# EAGLE schematic 001000-001 (EAGLE 9.4.0)

## Sheet 1 of 6
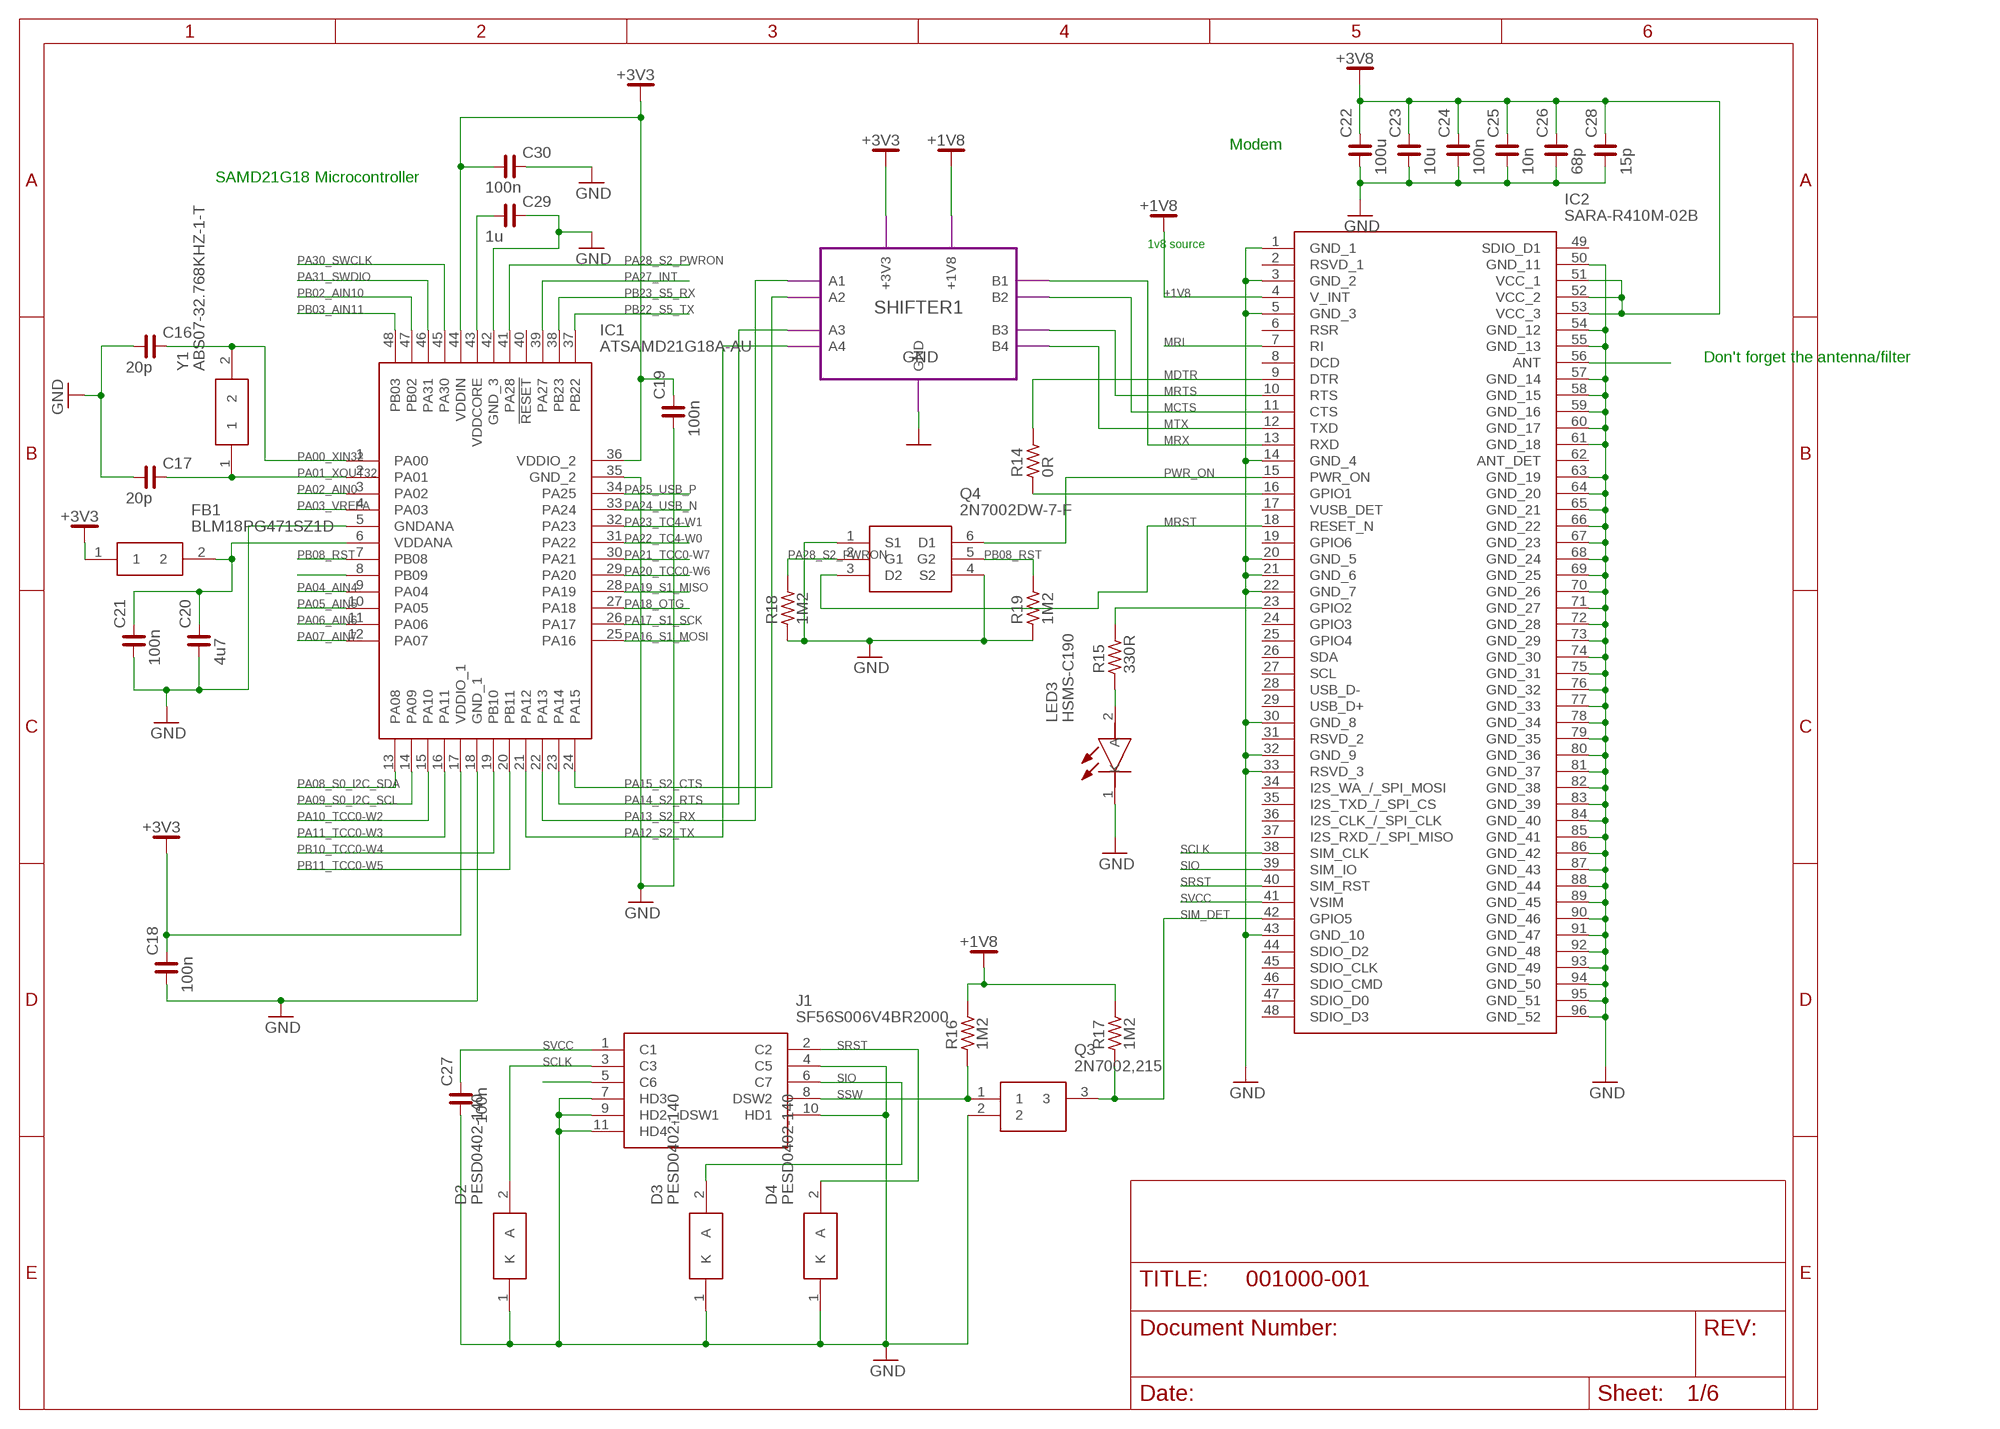
[diagram p0: schematic, sheet 1]

### Parts
C16  20p  C_0402  [C0402]
C17  20p  C_0402  [C0402]
C18  100n  C_0402  [C0402]
C19  100n  C_0402  [C0402]
C20  4u7  C_0603  [C0603]
C21  100n  C_0402  [C0402]
C22  100u  C_1206  [C1206]
C23  10u  C_0603  [C0603]
C24  100n  C_0402  [C0402]
C25  10n  C_0402  [C0402]
C26  68p  C_0402  [C0402]
C27  100n  C_0402  [C0402]
C28  15p  C_0402  [C0402]
C29  1u  C_0402  [C0402]
C30  100n  C_0402  [C0402]
D2  PESD0402-140  [DIONC1005X43N]
D3  PESD0402-140  [DIONC1005X43N]
D4  PESD0402-140  [DIONC1005X43N]
FB1  BLM18PG471SZ1D  [BEADC1608X95N]
IC1  ATSAMD21G18A-AU  [QFP50P900X900X120-48N]
IC2  SARA-R410M-02B  [SARA-U201-03B]
J1  SF56S006V4BR2000  [SF56S006V4BR2000]
LED3  HSMS-C190  [LEDC1608X90N]
Q3  2N7002,215  [SOT95P230X110-3N]
Q4  2N7002DW-7-F  [SOT65P210X100-6N]
R14  0R  R_0402  [R0402]
R15  330R  R_0402  [R0402]
R16  1M2  R_0402  [R0402]
R17  1M2  R_0402  [R0402]
R18  1M2  R_0402  [R0402]
R19  1M2  R_0402  [R0402]
Y1  ABS07-32.768KHZ-1-T  [ABS0716632768KHZT]

### Module instances
SHIFTER1 = SHIFTER

### Nets
+1V8: IC2.4(V_INT) R16.2 R17.2 ; port SHIFTER1.+1V8
+3V3: C18.2 C19.2 C30.1 FB1.1 IC1.17(VDDIO_1) IC1.36(VDDIO_2) IC1.44(VDDIN) ; port SHIFTER1.+3V3 ; also sheet 2,3,4,5
+3V8: C22.2 C23.2 C24.2 C25.2 C26.2 C28.2 IC2.51(VCC_1) IC2.52(VCC_2) IC2.53(VCC_3) ; also sheet 2
GND: C16.1 C17.1 C18.1 C19.1 C20.1 C21.1 C22.1 C23.1 C24.1 C25.1 C26.1 C27.1 C28.1 C29.2 C30.2 D2.1(K) D3.1(K) D4.1(K) IC1.5(GNDANA) IC1.18(GND_1) IC1.35(GND_2) IC1.42(GND_3) IC2.1(GND_1) IC2.3(GND_2) IC2.5(GND_3) IC2.14(GND_4) IC2.20(GND_5) IC2.21(GND_6) IC2.22(GND_7) IC2.30(GND_8) IC2.32(GND_9) IC2.33(RSVD_3) IC2.43(GND_10) IC2.50(GND_11) IC2.54(GND_12) IC2.55(GND_13) IC2.57(GND_14) IC2.58(GND_15) IC2.59(GND_16) IC2.60(GND_17) IC2.61(GND_18) IC2.63(GND_19) IC2.64(GND_20) IC2.65(GND_21) IC2.66(GND_22) IC2.67(GND_23) IC2.68(GND_24) IC2.69(GND_25) IC2.70(GND_26) IC2.71(GND_27) IC2.72(GND_28) IC2.73(GND_29) IC2.74(GND_30) IC2.75(GND_31) IC2.76(GND_32) IC2.77(GND_33) IC2.78(GND_34) IC2.79(GND_35) IC2.80(GND_36) IC2.81(GND_37) IC2.82(GND_38) IC2.83(GND_39) IC2.84(GND_40) IC2.85(GND_41) IC2.86(GND_42) IC2.87(GND_43) IC2.88(GND_44) IC2.89(GND_45) IC2.90(GND_46) IC2.91(GND_47) IC2.92(GND_48) IC2.93(GND_49) IC2.94(GND_50) IC2.95(GND_51) IC2.96(GND_52) J1.4(C5) J1.7(HD3) J1.9(HD2,_DSW1) J1.10(HD1) J1.11(HD4) LED3.1(K) Q3.2 Q4.1(S1) Q4.4(S2) R18.1 R19.1 ; port SHIFTER1.GND ; also sheet 2,3,4,5
MCTS: IC2.11(CTS) ; port SHIFTER1.B2
MDTR: IC2.9(DTR) R14.2
MRI: IC2.7(RI)
MRST: IC2.18(RESET_N) Q4.3(D2)
MRTS: IC2.10(RTS) ; port SHIFTER1.B3
MRX: IC2.13(RXD) ; port SHIFTER1.B1
MTX: IC2.12(TXD) ; port SHIFTER1.B4
N$1: C20.2 C21.2 FB1.2 IC1.6(VDDANA)
N$2: IC2.56(ANT)
N$3: IC2.16(GPIO1) R14.1
N$4: IC2.23(GPIO2) R15.2
N$22: LED3.2(A) R15.1
N$24: J1.5(C6)
N$25: IC1.8(PB09)
N$26: C29.1 IC1.43(VDDCORE)
PA00_XIN32: C16.2 IC1.1(PA00) Y1.2
PA01_XOUT32: C17.2 IC1.2(PA01) Y1.1
PA02_AIN0: IC1.3(PA02) ; also sheet 4
PA03_VREFA: IC1.4(PA03)
PA04_AIN4: IC1.9(PA04) ; also sheet 3
PA05_AIN5: IC1.10(PA05)
PA06_AIN6: IC1.11(PA06)
PA07_AIN7: IC1.12(PA07) ; also sheet 4
PA08_S0_I2C_SDA: IC1.13(PA08) ; also sheet 2,3
PA09_S0_I2C_SCL: IC1.14(PA09) ; also sheet 2,3
PA10_TCC0-W2: IC1.15(PA10)
PA11_TCC0-W3: IC1.16(PA11) ; also sheet 4
PA12_S2_TX: IC1.21(PA12) ; port SHIFTER1.A4
PA13_S2_RX: IC1.22(PA13) ; port SHIFTER1.A1
PA14_S2_RTS: IC1.23(PA14) ; port SHIFTER1.A3
PA15_S2_CTS: IC1.24(PA15) ; port SHIFTER1.A2
PA16_S1_MOSI: IC1.25(PA16) ; also sheet 3,4
PA17_S1_SCK: IC1.26(PA17) ; also sheet 3,4
PA18_OTG: IC1.27(PA18) ; also sheet 2
PA19_S1_MISO: IC1.28(PA19) ; also sheet 3,4
PA20_TCC0-W6: IC1.29(PA20) ; also sheet 3
PA21_TCC0-W7: IC1.30(PA21) ; also sheet 4
PA22_TC4-W0: IC1.31(PA22) ; also sheet 3
PA23_TC4-W1: IC1.32(PA23) ; also sheet 3
PA24_USB_N: IC1.33(PA24)
PA25_USB_P: IC1.34(PA25)
PA27_INT: IC1.39(PA27) ; also sheet 2
PA28_S2_PWRON: IC1.41(PA28) Q4.2(G1) R18.2
PA30_SWCLK: IC1.45(PA30)
PA31_SWDIO: IC1.46(PA31)
PB02_AIN10: IC1.47(PB02) ; also sheet 3
PB03_AIN11: IC1.48(PB03) ; also sheet 3
PB08_RST: IC1.7(PB08) Q4.5(G2) R19.2
PB10_TCC0-W4: IC1.19(PB10) ; also sheet 3
PB11_TCC0-W5: IC1.20(PB11) ; also sheet 3
PB22_S5_TX: IC1.37(PB22) ; also sheet 5
PB23_S5_RX: IC1.38(PB23) ; also sheet 5
PWR_ON: IC2.15(PWR_ON) Q4.6(D1)
SCLK: D2.2(A) IC2.38(SIM_CLK) J1.3(C3)
SIM_DET: IC2.42(GPIO5) Q3.3 R17.1
SIO: D3.2(A) IC2.39(SIM_IO) J1.6(C7)
SRST: D4.2(A) IC2.40(SIM_RST) J1.2(C2)
SSW: J1.8(DSW2) Q3.1 R16.1
SVCC: C27.2 IC2.41(VSIM) J1.1(C1)
Unconnected: IC1.40(!RESET) IC2.2(RSVD_1) IC2.6(RSR) IC2.8(DCD) IC2.17(VUSB_DET) IC2.19(GPIO6) IC2.24(GPIO3) IC2.25(GPIO4) IC2.26(SDA) IC2.27(SCL) IC2.28(USB_D-) IC2.29(USB_D+) IC2.31(RSVD_2) IC2.34(I2S_WA_/_SPI_MOSI) IC2.35(I2S_TXD_/_SPI_CS) IC2.36(I2S_CLK_/_SPI_CLK) IC2.37(I2S_RXD_/_SPI_MISO) IC2.44(SDIO_D2) IC2.45(SDIO_CLK) IC2.46(SDIO_CMD) IC2.47(SDIO_D0) IC2.48(SDIO_D3) IC2.49(SDIO_D1) IC2.62(ANT_DET)

### Notes on the sheet
- Modem
- SAMD21G18 Microcontroller
- 1v8 source
- Don't forget the antenna/filter

## Sheet 2 of 6
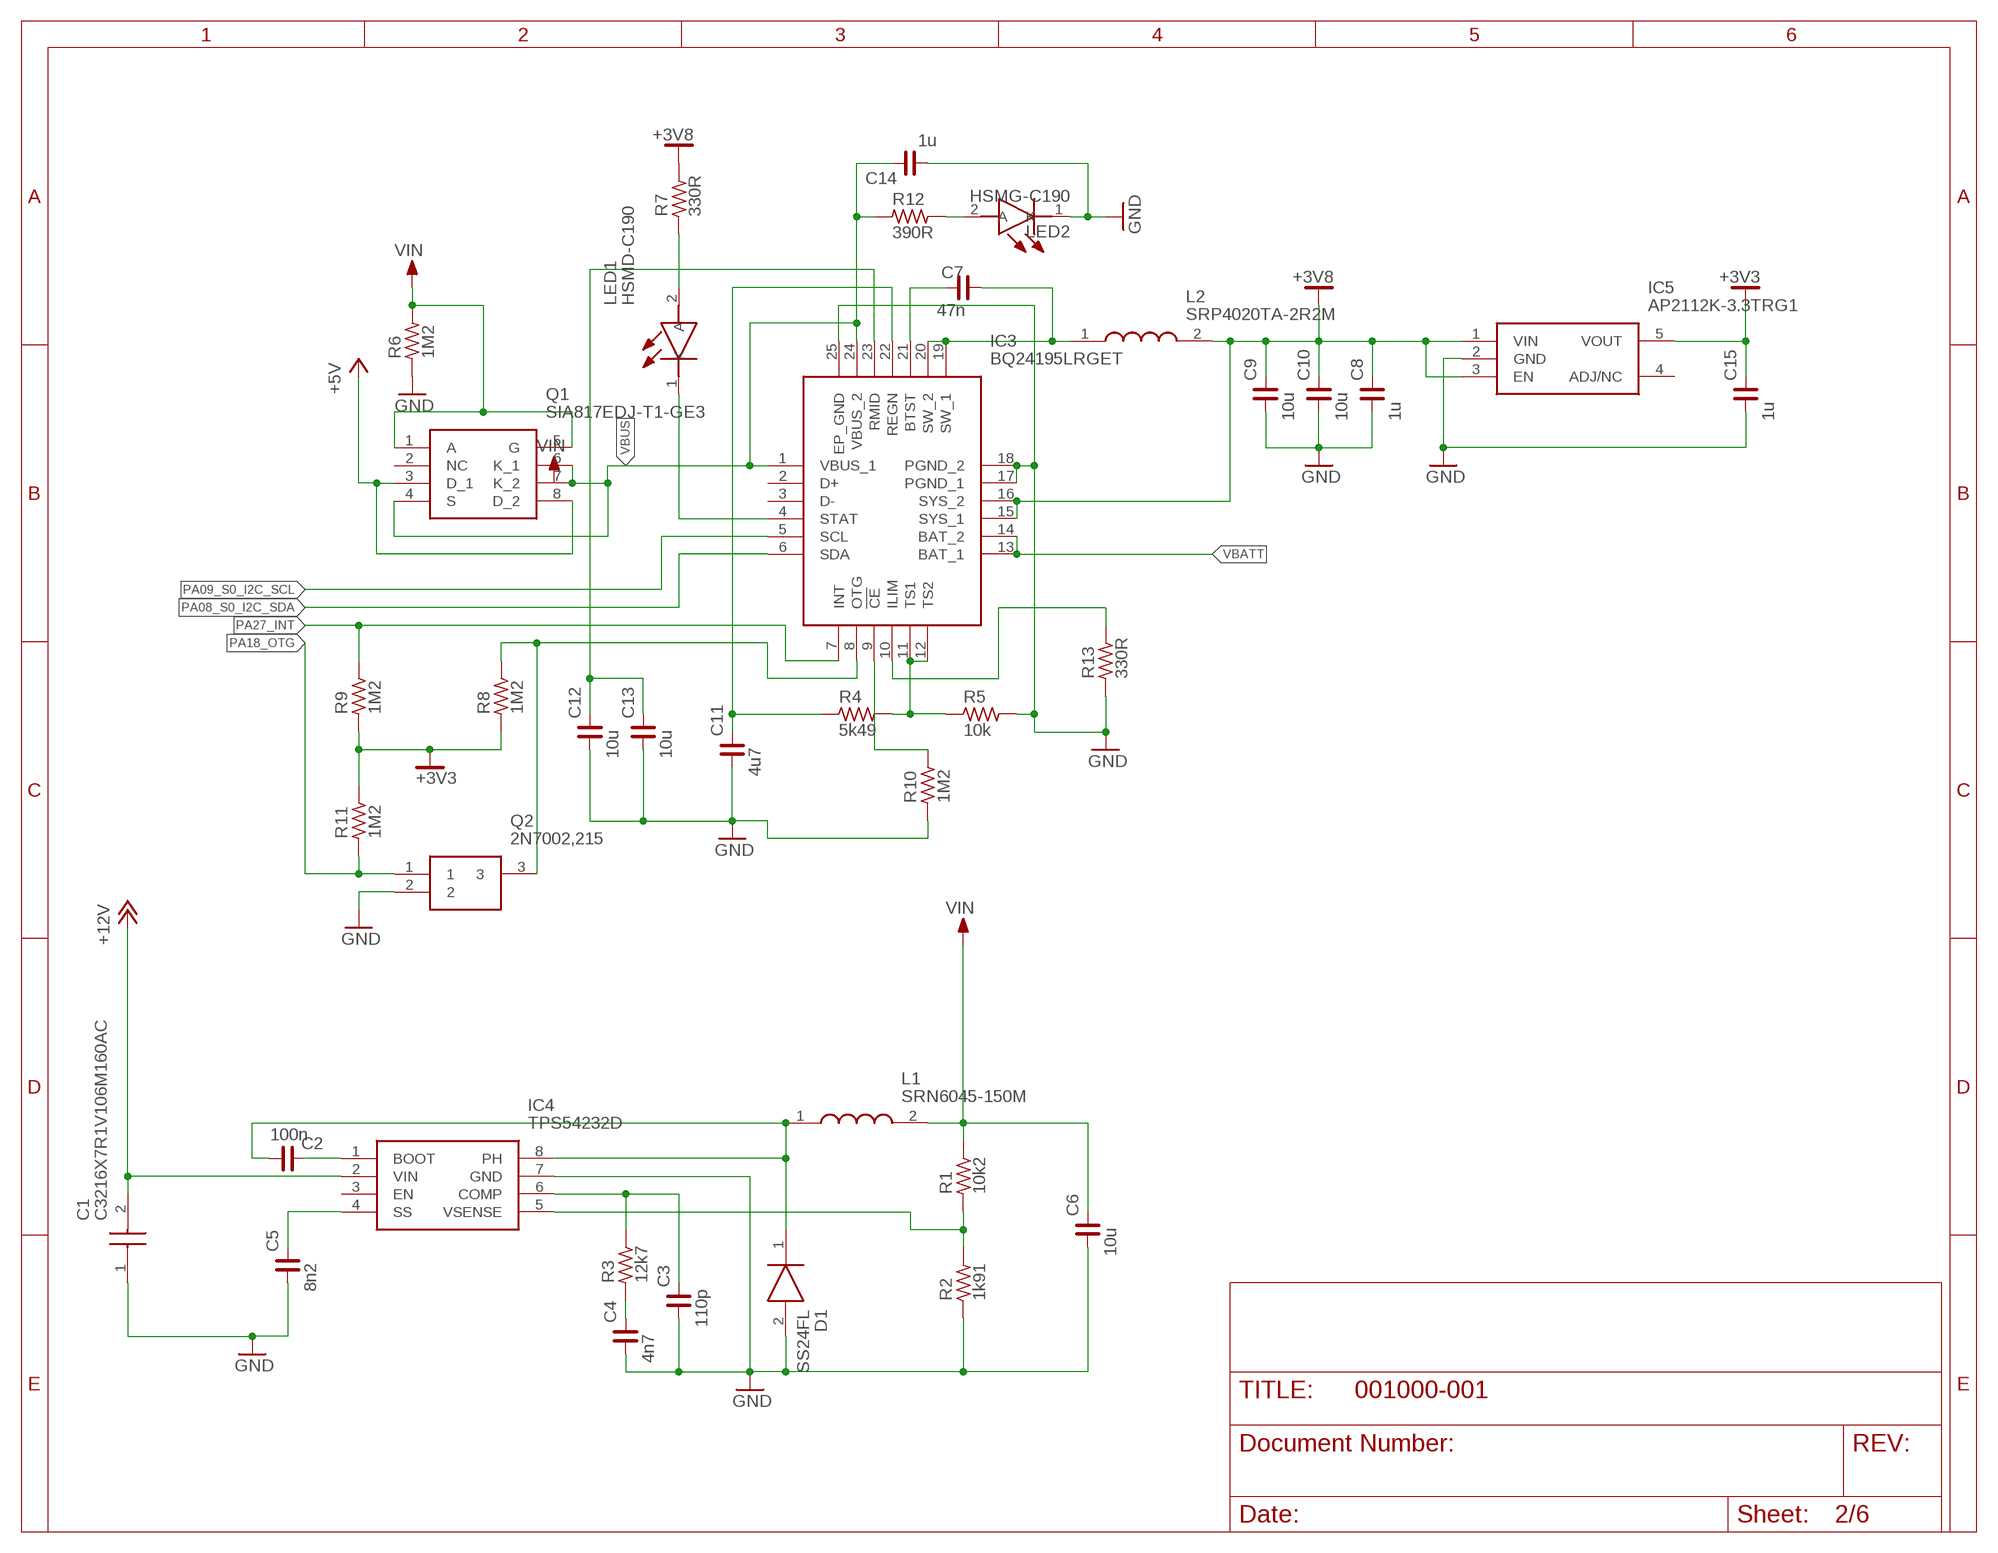
[diagram p1: schematic, sheet 2]

### Parts
C1  C3216X7R1V106M160AC  [CAPC3216X180N]
C2  100n  C_0402  [C0402]
C3  110p  C_0402  [C0402]
C4  4n7  C_0402  [C0402]
C5  8n2  C_0402  [C0402]
C6  10u  C_0603  [C0603]
C7  47n  C_0402  [C0402]
C8  1u  C_0402  [C0402]
C9  10u  C_0603  [C0603]
C10  10u  C_0603  [C0603]
C11  4u7  C_0402  [C0402]
C12  10u  C_0603  [C0603]
C13  10u  C_0603  [C0603]
C14  1u  C_0402  [C0402]
C15  1u  C_0402  [C0402]
D1  SS24FL  [SODFL3617X108N]
IC3  BQ24195LRGET  [QFN50P400X400X100-25N]
IC4  TPS54232D  [SOIC127P600X175-8N]
IC5  AP2112K-3.3TRG1  [SOT95P282X130-5N]
L1  SRN6045-150M  [SRN6045_1]
L2  SRP4020TA-2R2M  [INDC4441X200N]
LED1  HSMD-C190  [LEDC1608X80N]
LED2  HSMG-C190  [LEDC1608X90N]
Q1  SIA817EDJ-T1-GE3  [SIA537EDJT1GE3]
Q2  2N7002,215  [SOT95P230X110-3N]
R1  10k2  R_0402  [R0402]
R2  1k91  R_0402  [R0402]
R3  12k7  R_0402  [R0402]
R4  5k49  R_0402  [R0402]
R5  10k  R_0402  [R0402]
R6  1M2  R_0402  [R0402]
R7  330R  R_0402  [R0402]
R8  1M2  R_0402  [R0402]
R9  1M2  R_0402  [R0402]
R10  1M2  R_0402  [R0402]
R11  1M2  R_0402  [R0402]
R12  390R  R_0402  [R0402]
R13  330R  R_0402  [R0402]

### Nets
+3V3: C15.2 IC5.5(VOUT) R8.1 R9.1 R11.2 ; also sheet 1,3,4,5
+3V8: C8.2 C9.2 C10.2 IC3.15(SYS_1) IC3.16(SYS_2) IC5.1(VIN) IC5.3(EN) L2.2 R7.2 ; also sheet 1
+5V: Q1.3(D_1) Q1.8(D_2)
+12V: C1.2 IC4.2(VIN)
GND: C1.1 C3.1 C4.1 C5.1 C6.1 C8.1 C9.1 C10.1 C11.1 C12.1 C13.1 C14.1 C15.1 D1.2(A) IC3.17(PGND_1) IC3.18(PGND_2) IC3.25(EP_GND) IC4.7(GND) IC5.2(GND) LED2.1(K) Q2.2 R2.1 R5.2 R6.1 R10.1 R13.1 ; also sheet 1,3,4,5
N$5: C2.2 IC4.1(BOOT)
N$6: C2.1 D1.1(K) IC4.8(PH) L1.1
N$7: C3.2 IC4.6(COMP) R3.2
N$8: C4.2 R3.1
N$9: IC4.5(VSENSE) R1.1 R2.2
N$10: IC3.4(STAT) LED1.1(K)
N$11: C5.2 IC4.4(SS)
N$12: C7.2 IC3.19(SW_1) IC3.20(SW_2) L2.1
N$13: IC3.11(TS1) IC3.12(TS2) R4.2 R5.1
N$14: C12.2 C13.2 IC3.23(RMID)
N$15: LED2.2(A) R12.2
N$16: LED1.2(A) R7.1
N$17: IC3.9(!CE) R10.2
N$18: C7.1 IC3.21(BTST)
N$19: IC3.10(ILIM) R13.2
N$20: C11.2 IC3.22(REGN) R4.1
N$21: IC3.8(OTG) Q2.3 R8.2
PA08_S0_I2C_SDA: IC3.6(SDA) ; also sheet 1,3
PA09_S0_I2C_SCL: IC3.5(SCL) ; also sheet 1,3
PA18_OTG: Q2.1 R11.1 ; also sheet 1
PA27_INT: IC3.7(INT) R9.2 ; also sheet 1
VBATT: IC3.13(BAT_1) IC3.14(BAT_2)
VBUS: C14.2 IC3.1(VBUS_1) IC3.24(VBUS_2) Q1.4(S) Q1.6(K_1) Q1.7(K_2) R12.1
VIN: C6.2 L1.2 Q1.1(A) Q1.5(G) R1.2 R6.2 ; also sheet 4
Unconnected: IC3.2(D+) IC3.3(D-) IC4.3(EN) IC5.4(ADJ/NC) Q1.2(NC)

## Sheet 3 of 6
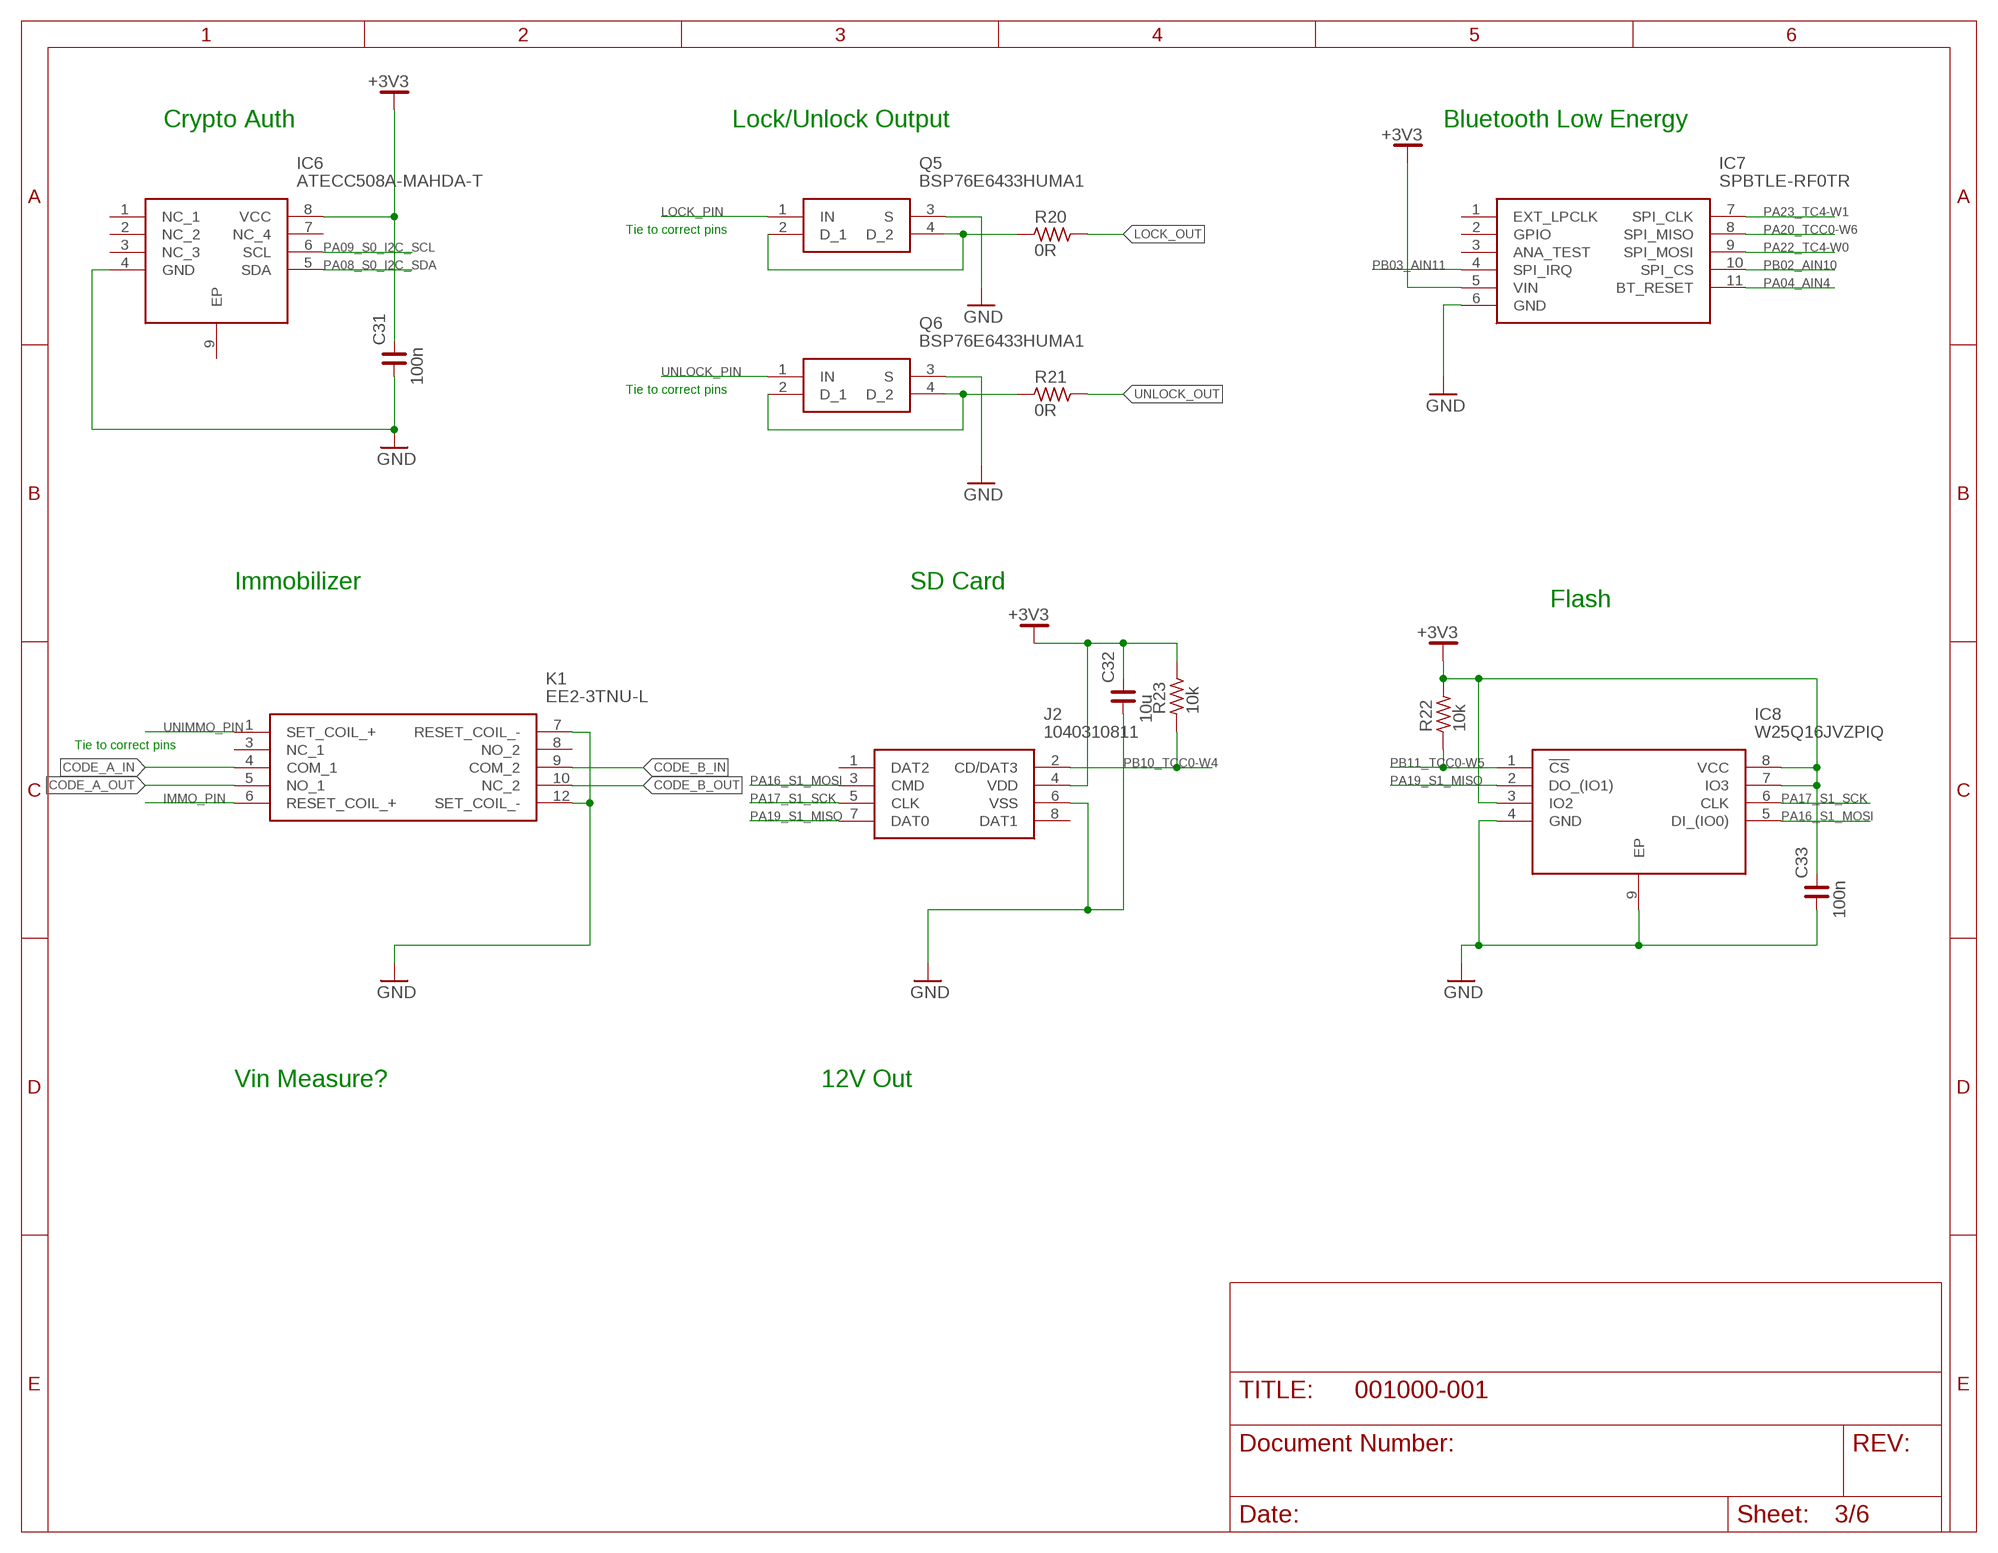
[diagram p2: schematic, sheet 3]

### Parts
C31  100n  C_0402  [C0402]
C32  10u  C_0402  [C0402]
C33  100n  C_0402  [C0402]
IC6  ATECC508A-MAHDA-T  [SON50P300X200X60-9N]
IC7  SPBTLE-RF0TR  [SPSGRF868]
IC8  W25Q16JVZPIQ  [SON127P600X500X80-9N]
J2  1040310811  [1040310811]
K1  EE2-3TNU-L  [EE25TNU]
Q5  BSP76E6433HUMA1  [SOT230P700X170-4N]
Q6  BSP76E6433HUMA1  [SOT230P700X170-4N]
R20  0R  R_1206  [R1206]
R21  0R  R_1206  [R1206]
R22  10k  R_0402  [R0402]
R23  10k  R_0402  [R0402]

### Nets
+3V3: C31.2 C32.2 C33.2 IC6.8(VCC) IC7.5(VIN) IC8.3(IO2) IC8.7(IO3) IC8.8(VCC) J2.4(VDD) R22.2 R23.2 ; also sheet 1,2,4,5
CODE_A_IN: K1.4(COM_1)
CODE_A_OUT: K1.5(NO_1)
CODE_B_IN: K1.9(COM_2)
CODE_B_OUT: K1.10(NC_2)
GND: C31.1 C32.1 C33.1 IC6.4(GND) IC7.6(GND) IC8.4(GND) IC8.9(EP) J2.6(VSS) K1.7(RESET_COIL_-) K1.12(SET_COIL_-) Q5.3(S) Q6.3(S) ; also sheet 1,2,4,5
IMMO_PIN: K1.6(RESET_COIL_+)
LOCK_OUT: R20.2
LOCK_PIN: Q5.1(IN)
N$28: Q6.2(D_1) Q6.4(D_2) R21.1
N$29: Q5.2(D_1) Q5.4(D_2) R20.1
PA04_AIN4: IC7.11(BT_RESET) ; also sheet 1
PA08_S0_I2C_SDA: IC6.5(SDA) ; also sheet 1,2
PA09_S0_I2C_SCL: IC6.6(SCL) ; also sheet 1,2
PA16_S1_MOSI: IC8.5(DI_(IO0)) J2.3(CMD) ; also sheet 1,4
PA17_S1_SCK: IC8.6(CLK) J2.5(CLK) ; also sheet 1,4
PA19_S1_MISO: IC8.2(DO_(IO1)) J2.7(DAT0) ; also sheet 1,4
PA20_TCC0-W6: IC7.8(SPI_MISO) ; also sheet 1
PA22_TC4-W0: IC7.9(SPI_MOSI) ; also sheet 1
PA23_TC4-W1: IC7.7(SPI_CLK) ; also sheet 1
PB02_AIN10: IC7.10(SPI_CS) ; also sheet 1
PB03_AIN11: IC7.4(SPI_IRQ) ; also sheet 1
PB10_TCC0-W4: J2.2(CD/DAT3) R23.1 ; also sheet 1
PB11_TCC0-W5: IC8.1(!CS) R22.1 ; also sheet 1
UNIMMO_PIN: K1.1(SET_COIL_+)
UNLOCK_OUT: R21.2
UNLOCK_PIN: Q6.1(IN)
Unconnected: IC6.1(NC_1) IC6.2(NC_2) IC6.3(NC_3) IC6.7(NC_4) IC6.9(EP) IC7.1(EXT_LPCLK) IC7.2(GPIO) IC7.3(ANA_TEST) J2.1(DAT2) J2.8(DAT1) K1.3(NC_1) K1.8(NO_2)

### Notes on the sheet
- Crypto Auth | Lock/Unlock Output | Bluetooth Low Energy
- Tie to correct pins
- Tie to correct pins
- Immobilizer | SD Card
- Flash
- Tie to correct pins
- Vin Measure? | 12V Out

## Sheet 4 of 6
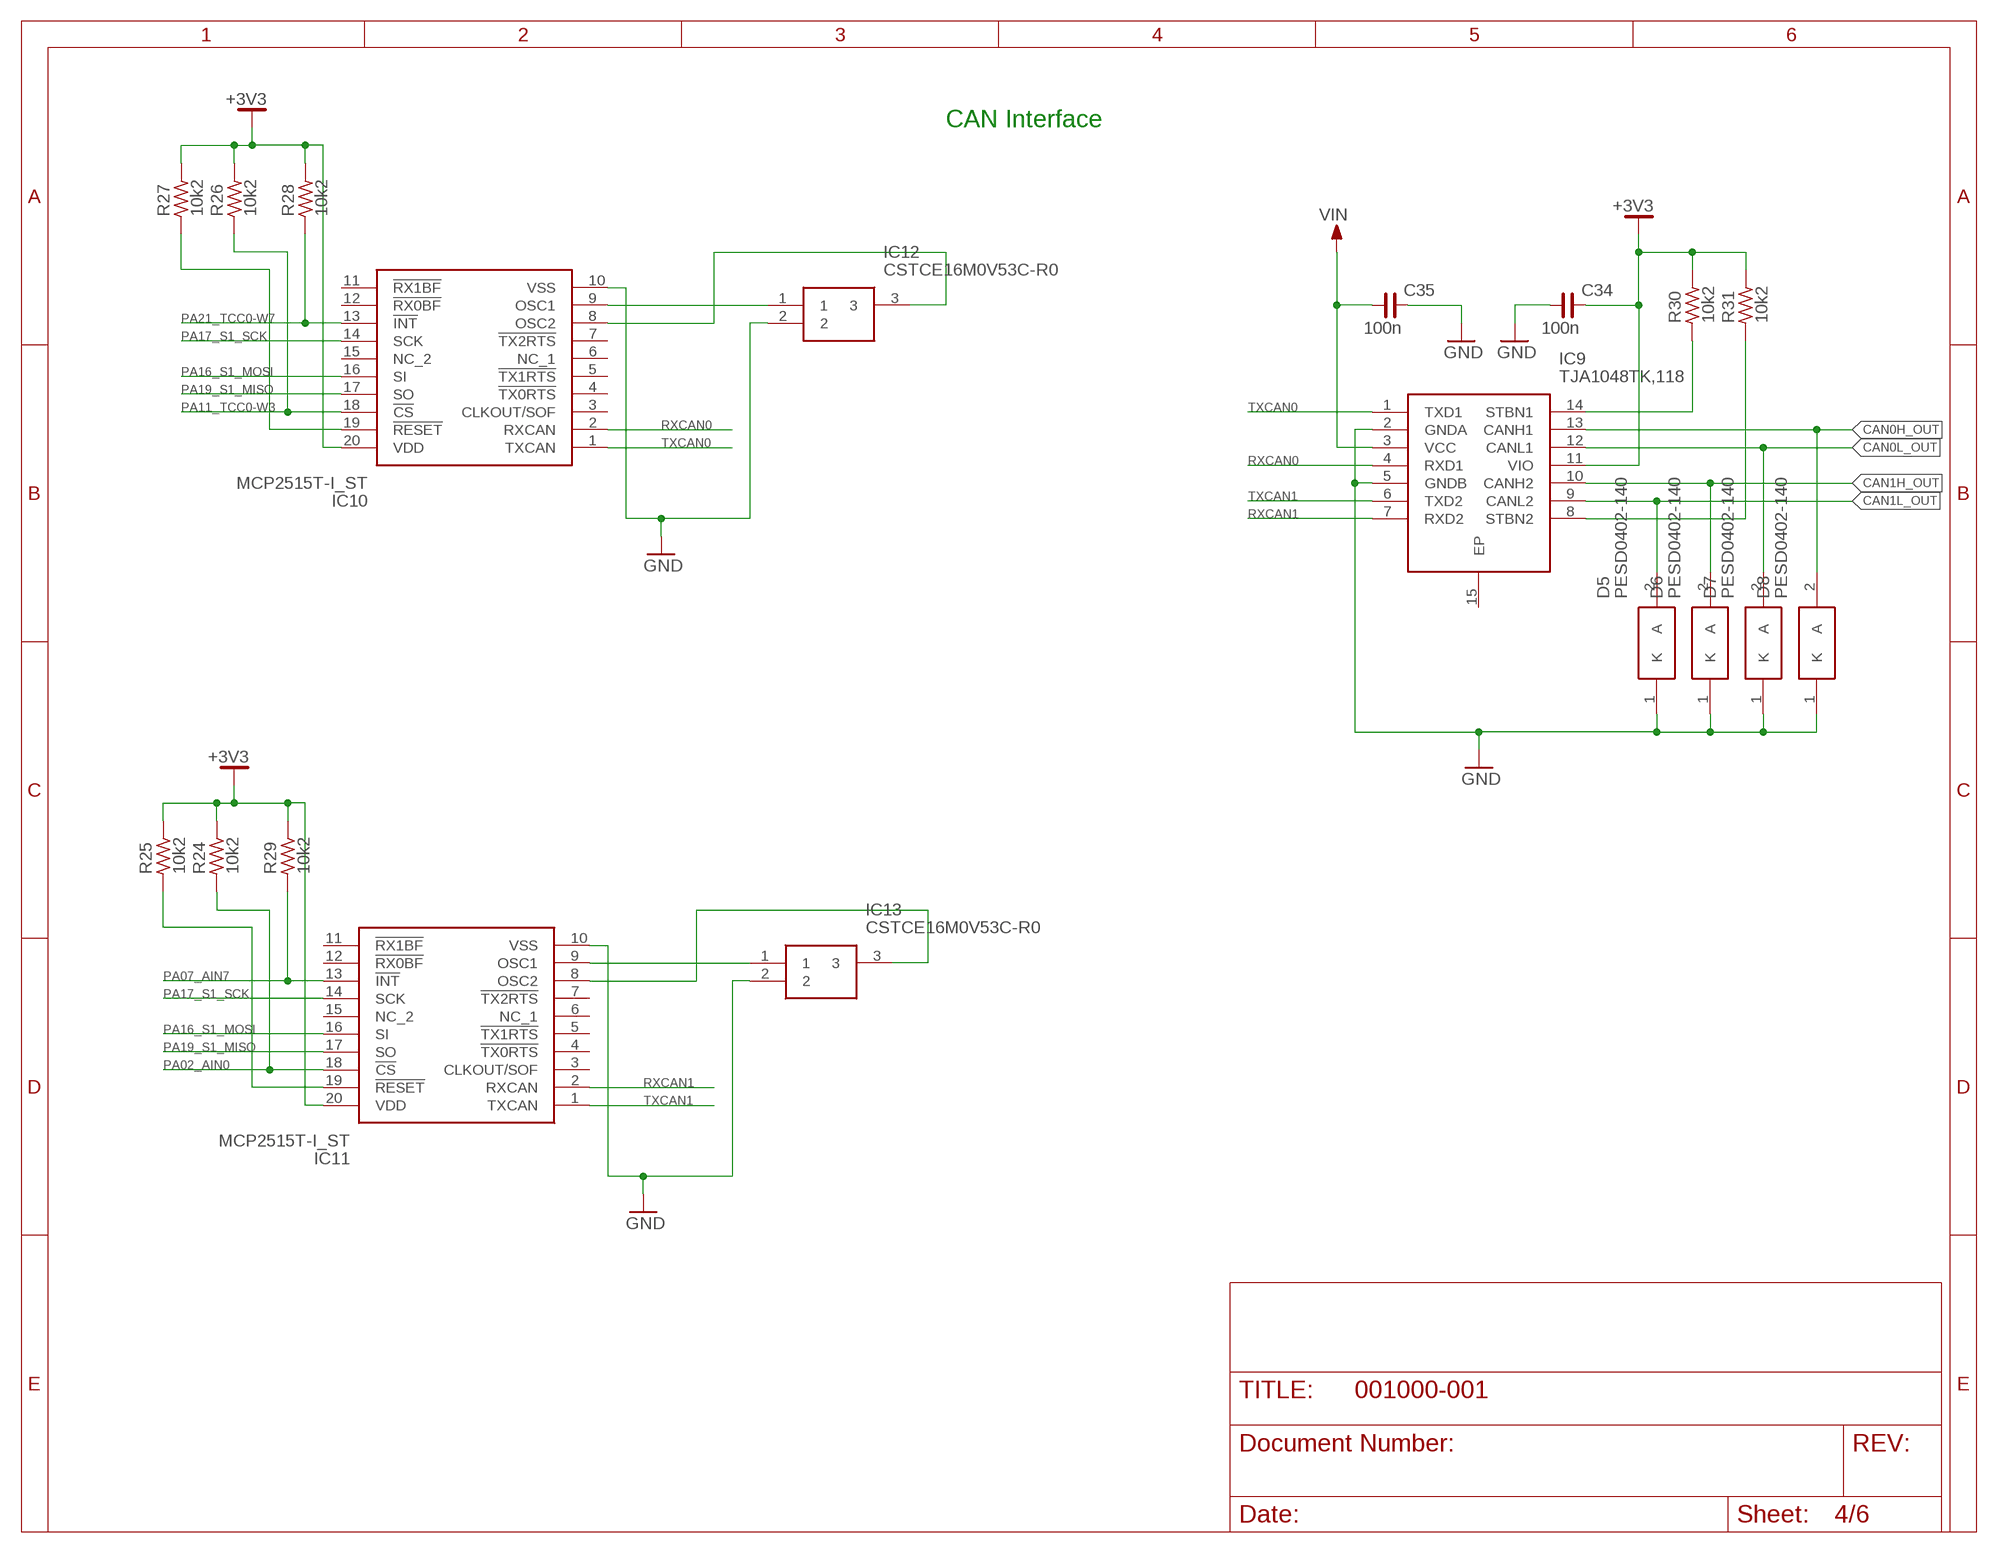
[diagram p3: schematic, sheet 4]

### Parts
C34  100n  C_0402  [C0402]
C35  100n  C_0402  [C0402]
D5  PESD0402-140  [DIONC1005X43N]
D6  PESD0402-140  [DIONC1005X43N]
D7  PESD0402-140  [DIONC1005X43N]
D8  PESD0402-140  [DIONC1005X43N]
IC9  TJA1048TK,118  [SON65P300X450X100-15N]
IC10  MCP2515T-I_ST  [SOP65P640X120-20N]
IC11  MCP2515T-I_ST  [SOP65P640X120-20N]
IC12  CSTCE16M0V53C-R0  [CSTCE16M0V53CR0]
IC13  CSTCE16M0V53C-R0  [CSTCE16M0V53CR0]
R24  10k2  R_0402  [R0402]
R25  10k2  R_0402  [R0402]
R26  10k2  R_0402  [R0402]
R27  10k2  R_0402  [R0402]
R28  10k2  R_0402  [R0402]
R29  10k2  R_0402  [R0402]
R30  10k2  R_0402  [R0402]
R31  10k2  R_0402  [R0402]

### Nets
+3V3: C34.2 IC9.11(VIO) IC10.20(VDD) IC11.20(VDD) R24.2 R25.2 R26.2 R27.2 R28.2 R29.2 R30.2 R31.2 ; also sheet 1,2,3,5
CAN0H_OUT: D8.2(A) IC9.13(CANH1)
CAN0L_OUT: D7.2(A) IC9.12(CANL1)
CAN1H_OUT: D6.2(A) IC9.10(CANH2)
CAN1L_OUT: D5.2(A) IC9.9(CANL2)
GND: C34.1 C35.2 D5.1(K) D6.1(K) D7.1(K) D8.1(K) IC9.2(GNDA) IC9.5(GNDB) IC10.10(VSS) IC11.10(VSS) IC12.2 IC13.2 ; also sheet 1,2,3,5
N$27: IC10.9(OSC1) IC12.1
N$30: IC10.8(OSC2) IC12.3
N$31: IC9.14(STBN1) R30.1
N$32: IC11.9(OSC1) IC13.1
N$33: IC11.8(OSC2) IC13.3
N$34: IC9.8(STBN2) R31.1
N$39: IC11.19(!RESET) R25.1
N$42: IC10.19(!RESET) R27.1
PA02_AIN0: IC11.18(!CS) R24.1 ; also sheet 1
PA07_AIN7: IC11.13(!INT) R29.1 ; also sheet 1
PA11_TCC0-W3: IC10.18(!CS) R26.1 ; also sheet 1
PA16_S1_MOSI: IC10.16(SI) IC11.16(SI) ; also sheet 1,3
PA17_S1_SCK: IC10.14(SCK) IC11.14(SCK) ; also sheet 1,3
PA19_S1_MISO: IC10.17(SO) IC11.17(SO) ; also sheet 1,3
PA21_TCC0-W7: IC10.13(!INT) R28.1 ; also sheet 1
RXCAN0: IC9.4(RXD1) IC10.2(RXCAN)
RXCAN1: IC9.7(RXD2) IC11.2(RXCAN)
TXCAN0: IC9.1(TXD1) IC10.1(TXCAN)
TXCAN1: IC9.6(TXD2) IC11.1(TXCAN)
VIN: C35.1 IC9.3(VCC) ; also sheet 2
Unconnected: IC9.15(EP) IC10.3(CLKOUT/SOF) IC10.4(!TX0RTS) IC10.5(!TX1RTS) IC10.6(NC_1) IC10.7(!TX2RTS) IC10.11(!RX1BF) IC10.12(!RX0BF) IC10.15(NC_2) IC11.3(CLKOUT/SOF) IC11.4(!TX0RTS) IC11.5(!TX1RTS) IC11.6(NC_1) IC11.7(!TX2RTS) IC11.11(!RX1BF) IC11.12(!RX0BF) IC11.15(NC_2)

### Notes on the sheet
- CAN Interface

## Sheet 5 of 6
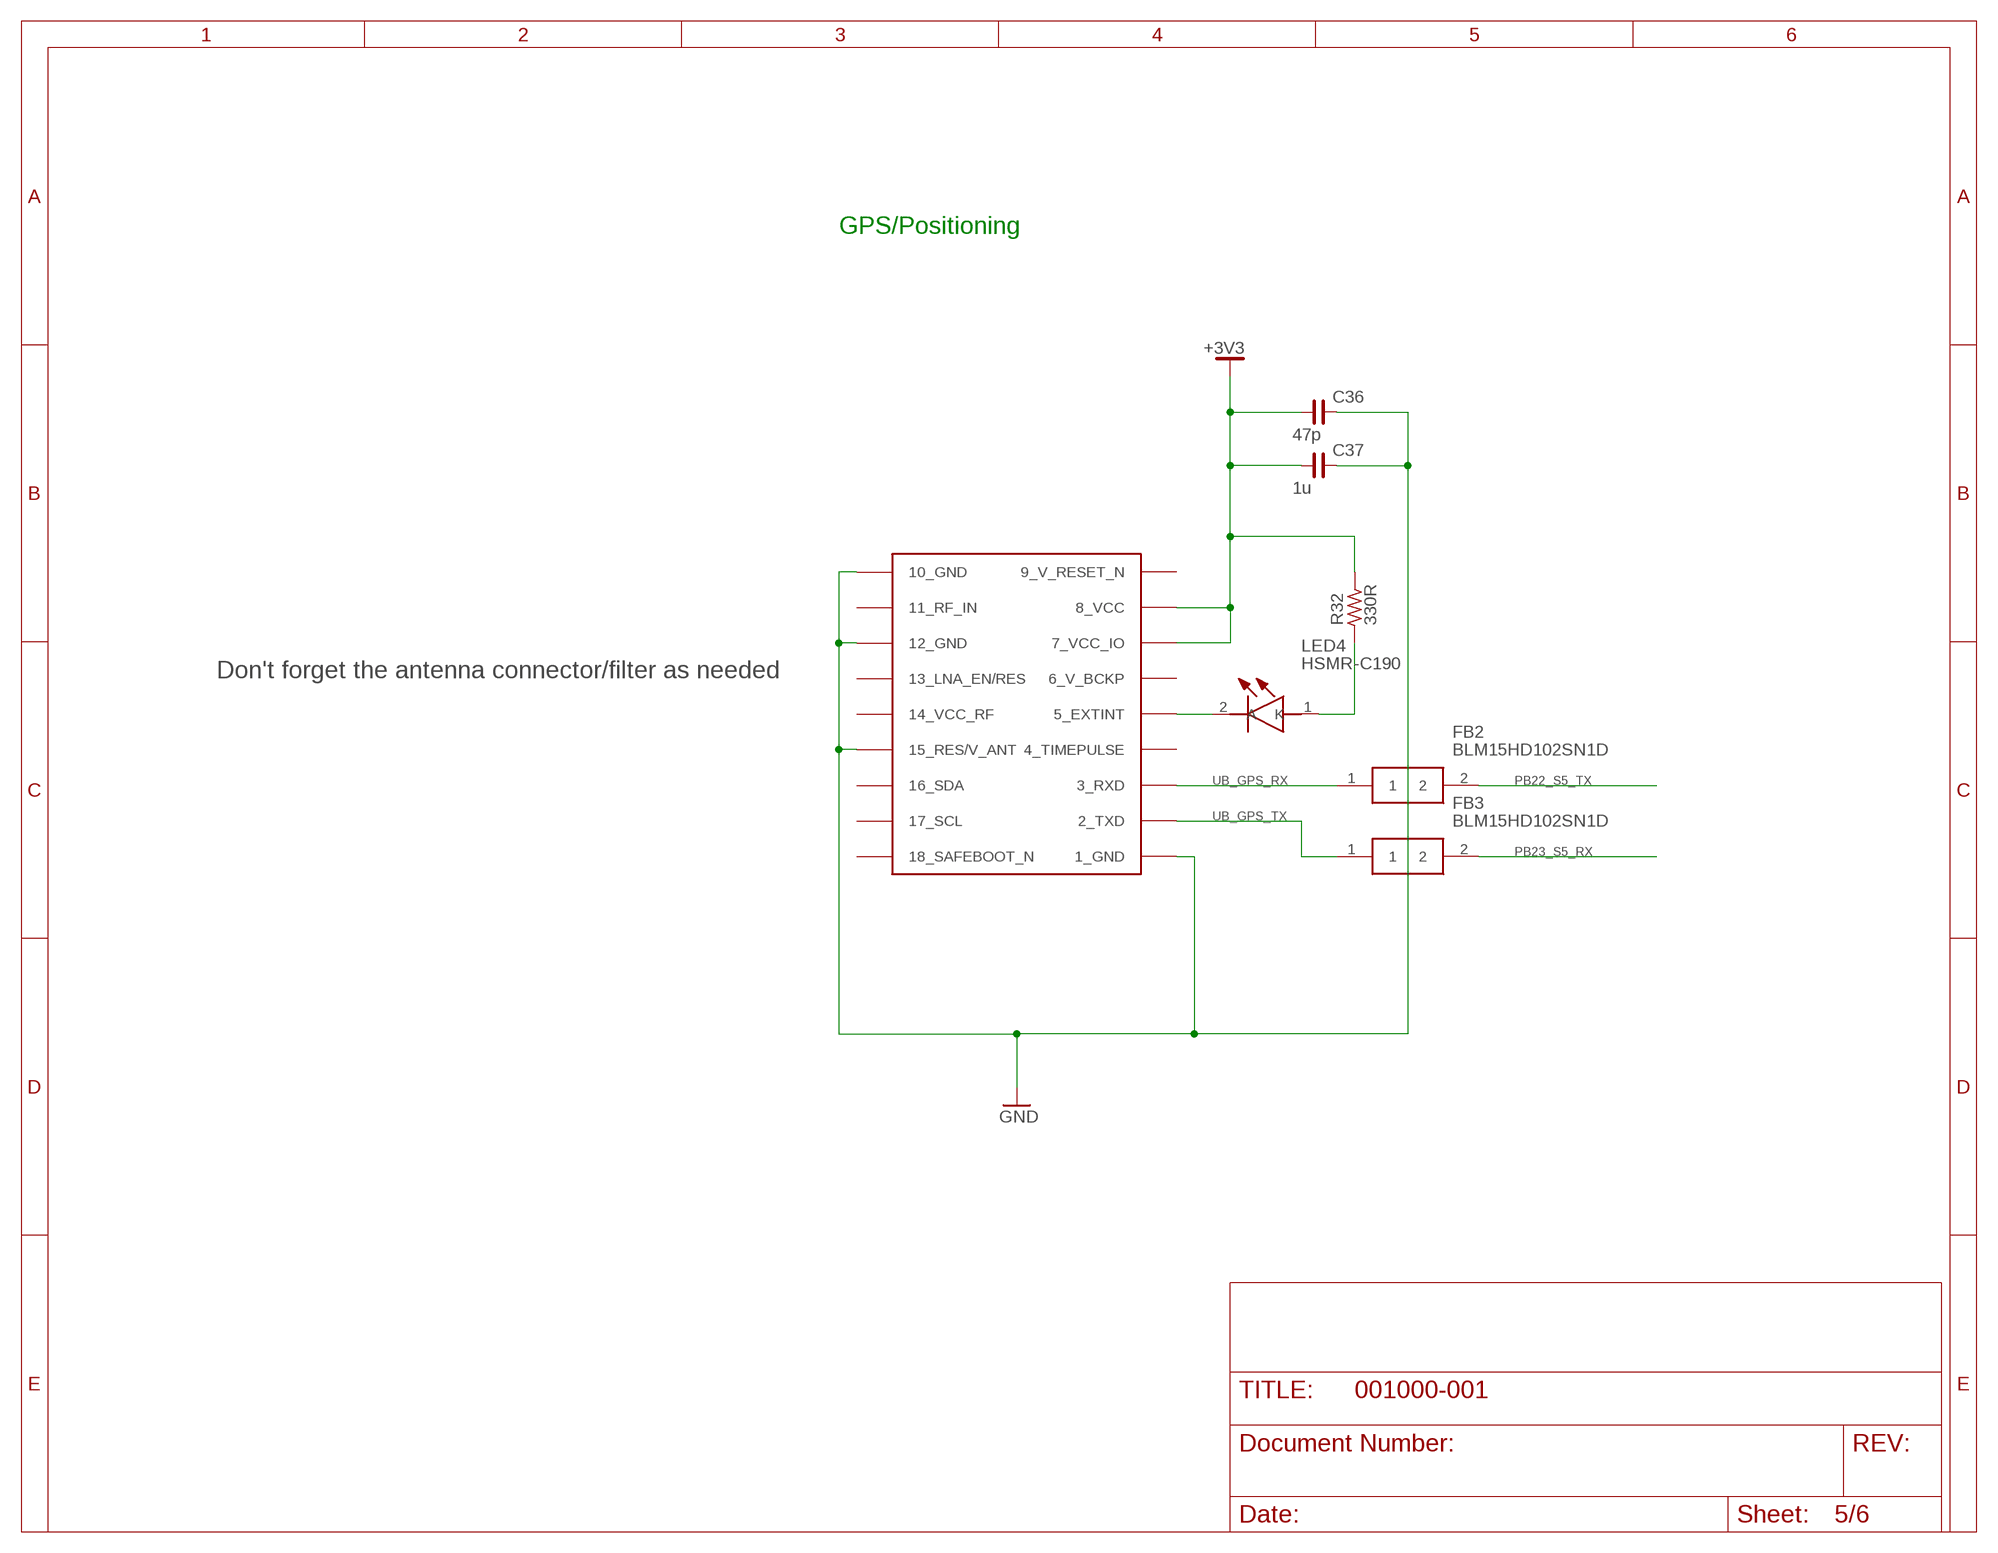
[diagram p4: schematic, sheet 5]

### Parts
C36  47p  C_0402  [C0402]
C37  1u  C_0603  [C0603]
FB2  BLM15HD102SN1D  [BEADC1005X55N]
FB3  BLM15HD102SN1D  [BEADC1005X55N]
LED4  HSMR-C190  [LEDC1608X80N]
R32  330R  R_0402  [R0402]
U$1  MAX-M8  [MAX-M8]

### Nets
+3V3: C36.1 C37.1 R32.2 U$1.7_VCC_IO U$1.8_VCC ; also sheet 1,2,3,4
GND: C36.2 C37.2 U$1.1_GND U$1.10_GND U$1.12_GND U$1.15_V_ANT/RESERVED(15_RES/V_ANT) ; also sheet 1,2,3,4
N$35: LED4.2(A) U$1.5_EXTINT
N$36: LED4.1(K) R32.1
PB22_S5_TX: FB2.2 ; also sheet 1
PB23_S5_RX: FB3.2 ; also sheet 1
UB_GPS_RX: FB2.1 U$1.3_RXD
UB_GPS_TX: FB3.1 U$1.2_TXD
Unconnected: U$1.4_TIMEPULSE U$1.6_V_BCKP U$1.11_RF_IN U$1.13_LNA_EN(13_LNA_EN/RES) U$1.14_VCC_RF U$1.16_SDA U$1.17_SCL U$1.18_SAFEBOOT_N

### Notes on the sheet
- GPS/Positioning
- Don't forget the antenna connector/filter as needed

## Sheet 6 of 6
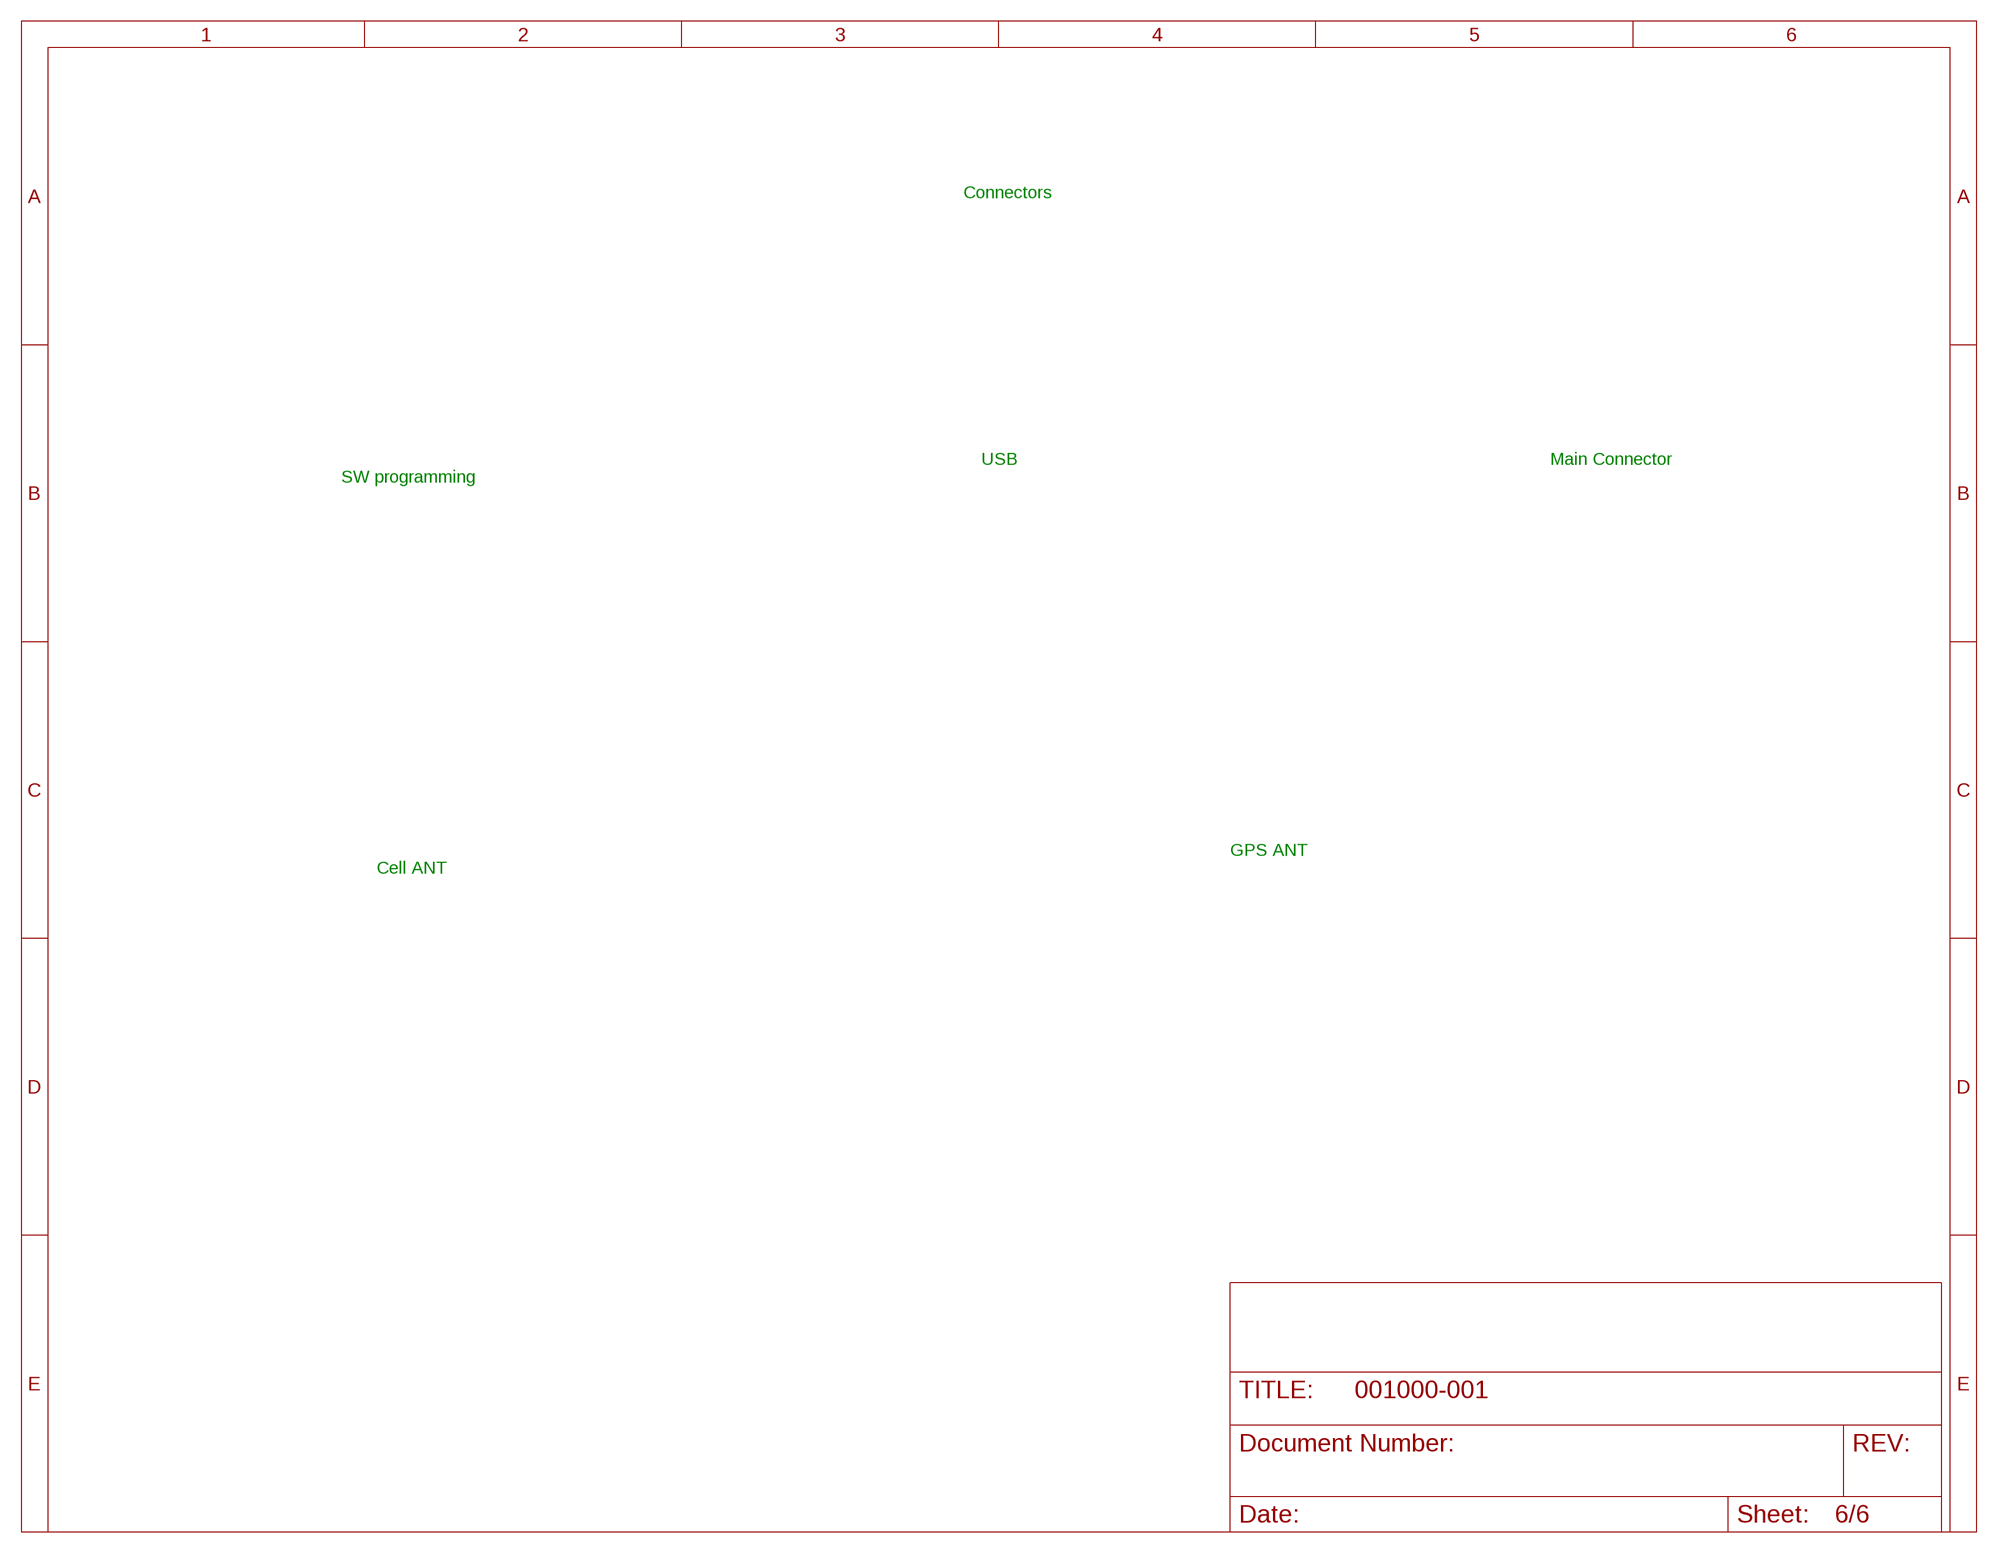
[diagram p5: schematic, sheet 6]

### Notes on the sheet
- Connectors
- USB | Main Connector
- SW programming
- GPS ANT
- Cell ANT

## Power pins joined to a net without a drawn wire
9_V_RESET_N: U$1.9_RESET_N(9_V_RESET_N)

## Library data of the parts
C1 = SamacSys_Parts:C3216X7R1V106M160AC: TDK 1206 C 10uF Ceramic Multilayer Capacitor, 35 V dc, +125C, X7R Dielectric, +/-20% Source: Datasheet <https://componentsearchengine.com/Datasheets/1/C3216X7R1V106M160AC.pdf>; DESCRIPTION: TDK 1206 C 10uF Ceramic Multilayer Capacitor, 35 V dc, +125C, X7R Dielectric, +/-20%; HEIGHT: 1.8mm; MANUFACTURER_NAME: TDK; MANUFACTURER_PART_NUMBER: C3216X7R1V106M160AC; MOUSER_PART_NUMBER: 810-C3216X7R1V106M; MOUSER_PRICE-STOCK: https://www.mouser.com/Search/Refine.aspx?Keyword=810-C3216X7R1V106M
C2-C37 = rc-master:C_: NON-POLARIZED CAP
D1 = SamacSys_Parts:SS24FL: Schottky Diodes & Rectifiers 40V, 2A SCHOTTKY Source: Datasheet <https://componentsearchengine.com/Datasheets/1/SS24FL.pdf>; DESCRIPTION: Schottky Diodes & Rectifiers 40V, 2A SCHOTTKY; HEIGHT: 1.08mm; MANUFACTURER_NAME: Fairchild Semiconductor; MANUFACTURER_PART_NUMBER: SS24FL; MOUSER_PART_NUMBER: 512-SS24FL; MOUSER_PRICE-STOCK: https://www.mouser.com/Search/Refine.aspx?Keyword=512-SS24FL
D2-D8 = SamacSys_Parts:PESD0402-140: TVS Diode Bi-Directional PESD0402-140 40V, SOD-923 2-Pin Source: Datasheet <http://www.te.com/commerce/DocumentDelivery/DDEController?Action=showdoc&DocId=Specification Or StandardSCD27440FpdfEnglishENG_SS_SCD27440_F.pdfRF1600-000.pdf>; DESCRIPTION: TVS Diode Bi-Directional PESD0402-140 40V, SOD-923 2-Pin; HEIGHT: 0.43mm; MANUFACTURER_NAME: TE Connectivity; MANUFACTURER_PART_NUMBER: PESD0402-140
FB1 = SamacSys_Parts:BLM18PG471SZ1D: Ferrite Beads 0603 470ohms 1000mA Auto Infotainment Source: Datasheet <https://componentsearchengine.com/Datasheets/1/BLM18PG471SZ1D.pdf>; DESCRIPTION: Ferrite Beads 0603 470ohms 1000mA Auto Infotainment; HEIGHT: 0.95mm; MANUFACTURER_NAME: Murata Electronics; MANUFACTURER_PART_NUMBER: BLM18PG471SZ1D; MOUSER_PART_NUMBER: 81-BLM18PG471SZ1D; MOUSER_PRICE-STOCK: https://www.mouser.com/Search/Refine.aspx?Keyword=81-BLM18PG471SZ1D
FB2 FB3 = SamacSys_Parts:BLM15HD102SN1D: MURATA - BLM15HD102SN1D - FERRITE BEAD, 1.25OHM, 250MA, 0402 Source: Datasheet <https://componentsearchengine.com/Datasheets/1/BLM15HD102SN1D.pdf>; DESCRIPTION: MURATA - BLM15HD102SN1D - FERRITE BEAD, 1.25OHM, 250MA, 0402; HEIGHT: 0.55mm; MANUFACTURER_NAME: Murata Electronics; MANUFACTURER_PART_NUMBER: BLM15HD102SN1D; MOUSER_PART_NUMBER: 81-BLM15HD102SN1D; MOUSER_PRICE-STOCK: https://www.mouser.com/Search/Refine.aspx?Keyword=81-BLM15HD102SN1D
IC1 = SamacSys_Parts:ATSAMD21G18A-AU: ATMEL - ATSAMD21G18A-AU - MCU, 32BIT, CORTEX-M0+, 48MHZ, TQFP-48 Source: Datasheet <https://componentsearchengine.com/Datasheets/1/ATSAMD21G18A-AU.pdf>; DESCRIPTION: ATMEL - ATSAMD21G18A-AU - MCU, 32BIT, CORTEX-M0+, 48MHZ, TQFP-48; HEIGHT: 1.2mm; MANUFACTURER_NAME: Microchip; MANUFACTURER_PART_NUMBER: ATSAMD21G18A-AU; MOUSER_PART_NUMBER: 556-ATSAMD21G18A-AU; MOUSER_PRICE-STOCK: https://www.mouser.com/Search/Refine.aspx?Keyword=556-ATSAMD21G18A-AU
IC2 = SamacSys_Parts:SARA-R410M-02B: Size-optimized LTE Cat M1/NB1 and EGPRS modules Source: Datasheet <https://www.u-blox.com/sites/default/files/SARA-R4-N4_DataSheet_(UBX-16024152).pdf>; DESCRIPTION: Size-optimized LTE Cat M1/NB1 and EGPRS modules; HEIGHT: mm; MANUFACTURER_NAME: U-Blox; MANUFACTURER_PART_NUMBER: SARA-R410M-02B
IC3 = SamacSys_Parts:BQ24195LRGET: I2C Controlled 2.5A/4.5A Single Cell Charger with 5.1V 1.3A/2.1A Synchronous Boost Operation Source: Datasheet <http://www.ti.com/lit/ds/symlink/bq24195l.pdf>; DESCRIPTION: I2C Controlled 2.5A/4.5A Single Cell Charger with 5.1V 1.3A/2.1A Synchronous Boost Operation; HEIGHT: 1mm; MANUFACTURER_NAME: Texas Instruments; MANUFACTURER_PART_NUMBER: BQ24195LRGET; MOUSER_PART_NUMBER: 595-BQ24195LRGET; MOUSER_PRICE-STOCK: https://www.mouser.com/Search/Refine.aspx?Keyword=595-BQ24195LRGET
IC4 = SamacSys_Parts:TPS54232D: TPS54232D, Switching Regulator, Buck Controller, 2A, Adjustable, Minimum of 0.8 V, 1200 kHz, 8-Pin SOIC Source: Datasheet <http://www.ti.com/lit/ds/symlink/tps54232.pdf>; DESCRIPTION: TPS54232D, Switching Regulator, Buck Controller, 2A, Adjustable, Minimum of 0.8 V, 1200 kHz, 8-Pin SOIC; HEIGHT: 1.75mm; MANUFACTURER_NAME: Texas Instruments; MANUFACTURER_PART_NUMBER: TPS54232D; MOUSER_PART_NUMBER: 595-TPS54232D; MOUSER_PRICE-STOCK: https://www.mouser.com/Search/Refine.aspx?Keyword=595-TPS54232D
IC5 = SamacSys_Parts:AP2112K-3.3TRG1: 600mA 3.3V LDO Regulator Enable SOT23-5 DiodesZetex AP2112K-3.3TRG1, LDO Voltage Regulator, 3.3 V +/-1.5%, 2.5 6 Vin, 5-Pin SOT-23 Source: Datasheet <https://componentsearchengine.com/Datasheets/1/AP2112K-3.3TRG1.pdf>; DESCRIPTION: 600mA 3.3V LDO Regulator Enable SOT23-5 DiodesZetex AP2112K-3.3TRG1, LDO Voltage Regulator, 3.3 V +/-1.5%, 2.5 6 Vin, 5-Pin SOT-23; HEIGHT: 1.3mm; MANUFACTURER_NAME: Diodes Inc.; MANUFACTURER_PART_NUMBER: AP2112K-3.3TRG1; MOUSER_PART_NUMBER: 621-AP2112K-3.3TRG1; MOUSER_PRICE-STOCK: https://www.mouser.com/Search/Refine.aspx?Keyword=621-AP2112K-3.3TRG1
IC6 = SamacSys_Parts:ATECC508A-MAHDA-T: Microchip ATECC508A-MAHDA-T 10kb 8-Pin Crypto Authentication IC UDFN Source: Datasheet <https://componentsearchengine.com/Datasheets/1/ATECC508A-MAHDA-T.pdf>; DESCRIPTION: Microchip ATECC508A-MAHDA-T 10kb 8-Pin Crypto Authentication IC UDFN; HEIGHT: 0.6mm; MANUFACTURER_NAME: Microchip; MANUFACTURER_PART_NUMBER: ATECC508A-MAHDA-T; MOUSER_PART_NUMBER: 556-ATECC508A-MAHDAT; MOUSER_PRICE-STOCK: https://www.mouser.com/Search/Refine.aspx?Keyword=556-ATECC508A-MAHDAT
IC7 = SamacSys_Parts:SPBTLE-RF0TR: STMICROELECTRONICS - SPBTLE-RF0TR - BLUETOOTH MODULE, V4.1, 3.6V Source: Datasheet <https://componentsearchengine.com/Datasheets/1/SPBTLE-RF0TR.pdf>; DESCRIPTION: STMICROELECTRONICS - SPBTLE-RF0TR - BLUETOOTH MODULE, V4.1, 3.6V; HEIGHT: 3mm; MANUFACTURER_NAME: STMicroelectronics; MANUFACTURER_PART_NUMBER: SPBTLE-RF0TR; MOUSER_PART_NUMBER: 511-SPBTLE-RF0TR; MOUSER_PRICE-STOCK: https://www.mouser.com/Search/Refine.aspx?Keyword=511-SPBTLE-RF0TR
IC8 = SamacSys_Parts:W25Q16JVZPIQ: IC FLASH 16MBIT 133MHZ 8WSON Source: Datasheet <https://componentsearchengine.com/Datasheets/1/W25Q16JVZPIQ.pdf>; DESCRIPTION: IC FLASH 16MBIT 133MHZ 8WSON; HEIGHT: 0.8mm; MANUFACTURER_NAME: Winbond; MANUFACTURER_PART_NUMBER: W25Q16JVZPIQ; MOUSER_PART_NUMBER: 454-W25Q16JVZPIQ; MOUSER_PRICE-STOCK: https://www.mouser.com/Search/Refine.aspx?Keyword=454-W25Q16JVZPIQ
IC9 = SamacSys_Parts:TJA1048TK,118: CAN Interface IC Dual high-speed CAN transceiver with Standby mode Source: Datasheet <https://www.nxp.com/docs/en/data-sheet/TJA1048.pdf>; DESCRIPTION: CAN Interface IC Dual high-speed CAN transceiver with Standby mode; HEIGHT: 1mm; MANUFACTURER_NAME: Nexperia; MANUFACTURER_PART_NUMBER: TJA1048TK,118; MOUSER_PART_NUMBER: 771-TJA1048TK118; MOUSER_PRICE-STOCK: https://www.mouser.com/Search/Refine.aspx?Keyword=771-TJA1048TK118
IC10 IC11 = SamacSys_Parts:MCP2515T-I_ST: Stand-Alone CAN Controller SPI TSSOP20 Microchip MCP2515T-I/ST, CAN Controller 1Mbit/s CAN 2.0B, 20-Pin TSSOP Source: Datasheet <https://componentsearchengine.com/Datasheets/1/MCP2515T-I_ST.pdf>; DESCRIPTION: Stand-Alone CAN Controller SPI TSSOP20 Microchip MCP2515T-I/ST, CAN Controller 1Mbit/s CAN 2.0B, 20-Pin TSSOP; HEIGHT: 1.2mm; MANUFACTURER_NAME: Microchip; MANUFACTURER_PART_NUMBER: MCP2515T-I/ST; MOUSER_PART_NUMBER: 579-MCP2515T-I/ST; MOUSER_PRICE-STOCK: https://www.mouser.com/Search/Refine.aspx?Keyword=579-MCP2515T-I%2FST
IC12 IC13 = SamacSys_Parts:CSTCE16M0V53C-R0: SMD Ceramic Resonator 16 MHz 15PF CSTCE16M0V53C-R0, Ceramic Resonator, 16MHz Expander 15pF, 4-Pin, 3.2 x 1.3 x 0.9mm Source: Datasheet <https://componentsearchengine.com/Datasheets/1/CSTCE16M0V53C-R0.pdf>; DESCRIPTION: SMD Ceramic Resonator 16 MHz 15PF CSTCE16M0V53C-R0, Ceramic Resonator, 16MHz Expander 15pF, 4-Pin, 3.2 x 1.3 x 0.9mm; HEIGHT: 1mm; MANUFACTURER_NAME: Murata Electronics; MANUFACTURER_PART_NUMBER: CSTCE16M0V53C-R0; MOUSER_PART_NUMBER: 81-CSTCE16M0V53C-R0; MOUSER_PRICE-STOCK: https://www.mouser.com/Search/Refine.aspx?Keyword=81-CSTCE16M0V53C-R0
J1 = SamacSys_Parts:SF56S006V4BR2000: Memory Card Connectors microSIM LOW PROFILE PUSH-PUSH Source: Datasheet <https://componentsearchengine.com/Datasheets/1/SF56S006V4BR2000.pdf>; DESCRIPTION: Memory Card Connectors microSIM LOW PROFILE PUSH-PUSH; HEIGHT: mm; MANUFACTURER_NAME: JAE Electronics; MANUFACTURER_PART_NUMBER: SF56S006V4BR2000; MOUSER_PART_NUMBER: 656-SF56S006V4BR2000; MOUSER_PRICE-STOCK: https://www.mouser.com/Search/Refine.aspx?Keyword=656-SF56S006V4BR2000
J2 = SamacSys_Parts:1040310811: MICRO SD card socket, push-pull 1.42H Normal type Source: Datasheet <https://componentsearchengine.com/Datasheets/1/1040310811.pdf>; DESCRIPTION: MICRO SD card socket, push-pull 1.42H Normal type; HEIGHT: mm; MANUFACTURER_NAME: Molex; MANUFACTURER_PART_NUMBER: 1040310811; MOUSER_PART_NUMBER: N/A; MOUSER_PRICE-STOCK: https://www.mouser.com/Search/Refine.aspx?Keyword=N%2FA
K1 = SamacSys_Parts:EE2-3TNU-L: Relay Signal 2FormC 3V 10uA Source: Datasheet <https://componentsearchengine.com/Datasheets/1/EE2-3TNU-L.pdf>; DESCRIPTION: Relay Signal 2FormC 3V 10uA; HEIGHT: 10mm; MANUFACTURER_NAME: Kemet; MANUFACTURER_PART_NUMBER: EE2-3TNU-L; MOUSER_PART_NUMBER: 80-EE2-3TNU-L; MOUSER_PRICE-STOCK: https://www.mouser.com/Search/Refine.aspx?Keyword=80-EE2-3TNU-L
L1 = SamacSys_Parts:SRN6045-150M: Power Inductor semi-shielded SMD 15uH Bourns SRN6045 Series Shielded Wire-wound SMD Inductor with a Ferrite Core, 15 uH +/-20% Wire-Wound 2.3A Idc Source: Datasheet <https://componentsearchengine.com/Datasheets/1/SRN6045-150M.pdf>; DESCRIPTION: Power Inductor semi-shielded SMD 15uH Bourns SRN6045 Series Shielded Wire-wound SMD Inductor with a Ferrite Core, 15 uH +/-20% Wire-Wound 2.3A Idc; HEIGHT: mm; MANUFACTURER_NAME: Bourns; MANUFACTURER_PART_NUMBER: SRN6045-150M; MOUSER_PART_NUMBER: 652-SRN6045-150M; MOUSER_PRICE-STOCK: https://www.mouser.com/Search/Refine.aspx?Keyword=652-SRN6045-150M
L2 = SamacSys_Parts:SRP4020TA-2R2M: Bourns SRP4020TA Series Shielded Wire-wound SMD Inductor with a Carbonyl Powder Core, 2.2 uH +/-20% 4A Idc Source: Datasheet <https://componentsearchengine.com/Datasheets/1/SRP4020TA-2R2M.pdf>; DESCRIPTION: Bourns SRP4020TA Series Shielded Wire-wound SMD Inductor with a Carbonyl Powder Core, 2.2 uH +/-20% 4A Idc; HEIGHT: 2mm; MANUFACTURER_NAME: Bourns; MANUFACTURER_PART_NUMBER: SRP4020TA-2R2M; MOUSER_PART_NUMBER: 652-SRP4020TA-2R2M; MOUSER_PRICE-STOCK: https://www.mouser.com/Search/Refine.aspx?Keyword=652-SRP4020TA-2R2M
LED1 = SamacSys_Parts:HSMD-C190: Broadcom HSMD-C190 Orange LED, 604 nm 1608 (0603), Rectangle Lens SMD package Source: Datasheet <https://www.broadcom.com/products/leds-and-displays/chip-leds/0603-1.6-x-0.88mm-top-mount/hsmd-c190>; DESCRIPTION: Broadcom HSMD-C190 Orange LED, 604 nm 1608 (0603), Rectangle Lens SMD package; HEIGHT: 0.8mm; MANUFACTURER_NAME: Avago Technologies; MANUFACTURER_PART_NUMBER: HSMD-C190; MOUSER_PART_NUMBER: 630-HSMD-C190; MOUSER_PRICE-STOCK: https://www.mouser.com/Search/Refine.aspx?Keyword=630-HSMD-C190
LED2 = SamacSys_Parts:HSMG-C190: Broadcom HSMG-C190 Green LED, 572 nm 1608 (0603), Rectangle Lens SMD package Source: Datasheet; DESCRIPTION: Broadcom HSMG-C190 Green LED, 572 nm 1608 (0603), Rectangle Lens SMD package; HEIGHT: 0.9mm; MANUFACTURER_NAME: Avago Technologies; MANUFACTURER_PART_NUMBER: HSMG-C190; MOUSER_PART_NUMBER: 630-HSMG-C190; MOUSER_PRICE-STOCK: https://www.mouser.com/Search/Refine.aspx?Keyword=630-HSMG-C190
LED3 = SamacSys_Parts:HSMS-C190: Broadcom HSMS-C190 Red LED, 626 nm 1608 (0603), Rectangle Lens SMD package Source: Datasheet; DESCRIPTION: Broadcom HSMS-C190 Red LED, 626 nm 1608 (0603), Rectangle Lens SMD package; HEIGHT: 0.9mm; MANUFACTURER_NAME: Avago Technologies; MANUFACTURER_PART_NUMBER: HSMS-C190; MOUSER_PART_NUMBER: 630-HSMS-C190; MOUSER_PRICE-STOCK: https://www.mouser.com/Search/Refine.aspx?Keyword=630-HSMS-C190
LED4 = SamacSys_Parts:HSMR-C190: ChipLED,blue,469nm,55mcd,78mW,140deg Avago Blue LED, 55 mcd 140 0603 Source: Datasheet; DESCRIPTION: ChipLED,blue,469nm,55mcd,78mW,140deg Avago Blue LED, 55 mcd 140 0603; HEIGHT: 0.8mm; MANUFACTURER_NAME: Avago Technologies; MANUFACTURER_PART_NUMBER: HSMR-C190; MOUSER_PART_NUMBER: 630-HSMR-C190; MOUSER_PRICE-STOCK: https://www.mouser.com/Search/Refine.aspx?Keyword=630-HSMR-C190
Q1 = SamacSys_Parts:SIA817EDJ-T1-GE3: MOSFET -30V Vds 12V Vgs PowerPAK SC-70 Source: Datasheet <https://componentsearchengine.com/Datasheets/1/SIA817EDJ-T1-GE3.pdf>; DESCRIPTION: MOSFET -30V Vds 12V Vgs PowerPAK SC-70; HEIGHT: 0mm; MANUFACTURER_NAME: Vishay; MANUFACTURER_PART_NUMBER: SIA817EDJ-T1-GE3; MOUSER_PART_NUMBER: 78-SIA817EDJ-T1-GE3; MOUSER_PRICE-STOCK: https://www.mouser.com/Search/Refine.aspx?Keyword=78-SIA817EDJ-T1-GE3
Q2 Q3 = SamacSys_Parts:2N7002,215: MOSFET N-Channel 60V 0.3A TO236AB NXP 2N7002,215 N-channel MOSFET Transistor, 0.3 A, 60 V, 3-Pin TO-236AB Source: Datasheet <https://componentsearchengine.com/Datasheets/1/2N7002,215.pdf>; DESCRIPTION: MOSFET N-Channel 60V 0.3A TO236AB NXP 2N7002,215 N-channel MOSFET Transistor, 0.3 A, 60 V, 3-Pin TO-236AB; HEIGHT: 1.1mm; MANUFACTURER_NAME: Nexperia; MANUFACTURER_PART_NUMBER: 2N7002,215; MOUSER_PART_NUMBER: 771-2N7002-T/R; MOUSER_PRICE-STOCK: https://www.mouser.com/Search/Refine.aspx?Keyword=771-2N7002-T%2FR
Q4 = SamacSys_Parts:2N7002DW-7-F: Diodes Inc 2N7002DW-7-F Dual N-channel MOSFET, 115 mA, 60 V, 6-Pin SOT-363 Source: Datasheet <https://componentsearchengine.com/Datasheets/1/2N7002DW-7-F.pdf>; DESCRIPTION: Diodes Inc 2N7002DW-7-F Dual N-channel MOSFET, 115 mA, 60 V, 6-Pin SOT-363; HEIGHT: 1mm; MANUFACTURER_NAME: Diodes Inc.; MANUFACTURER_PART_NUMBER: 2N7002DW-7-F; MOUSER_PART_NUMBER: 621-2N7002DW-F; MOUSER_PRICE-STOCK: https://www.mouser.com/Search/Refine.aspx?Keyword=621-2N7002DW-F
Q5 Q6 = SamacSys_Parts:BSP76E6433HUMA1: INFINEON - BSP76E6433HUMA1 - POWER LOAD SW, AEC-Q100, 42V, SOT-223-4 Source: Datasheet; DESCRIPTION: INFINEON - BSP76E6433HUMA1 - POWER LOAD SW, AEC-Q100, 42V, SOT-223-4; HEIGHT: 1.7mm; MANUFACTURER_NAME: Infineon; MANUFACTURER_PART_NUMBER: BSP76E6433HUMA1
R1-R32 = rc-master:R_: RESISTOR
U$1 = ubloxLib:MAX-M8: u-blox MAX GNSS module
Y1 = SamacSys_Parts:ABS07-32.768KHZ-1-T: Abracon 32.768kHz Crystal Unit +/-10ppm SMD 2-Pin 3.2 x 1.5 x 0.9mm Source: Datasheet <https://componentsearchengine.com/Datasheets/1/ABS07-32.768KHZ-1-T.pdf>; DESCRIPTION: Abracon 32.768kHz Crystal Unit +/-10ppm SMD 2-Pin 3.2 x 1.5 x 0.9mm; HEIGHT: 0.9mm; MANUFACTURER_NAME: ABRACON; MANUFACTURER_PART_NUMBER: ABS07-32.768KHz-1-T; MOUSER_PART_NUMBER: 815-ABS07-32.7K-1-T; MOUSER_PRICE-STOCK: https://www.mouser.com/Search/Refine.aspx?Keyword=815-ABS07-32.7K-1-T

## Module SHIFTER
Ports: A1(out) A2(out) A3(in) A4(in) B1(in) B2(in) B3(out) B4(out) GND(pwr) +3V3(pwr) +1V8(pwr)
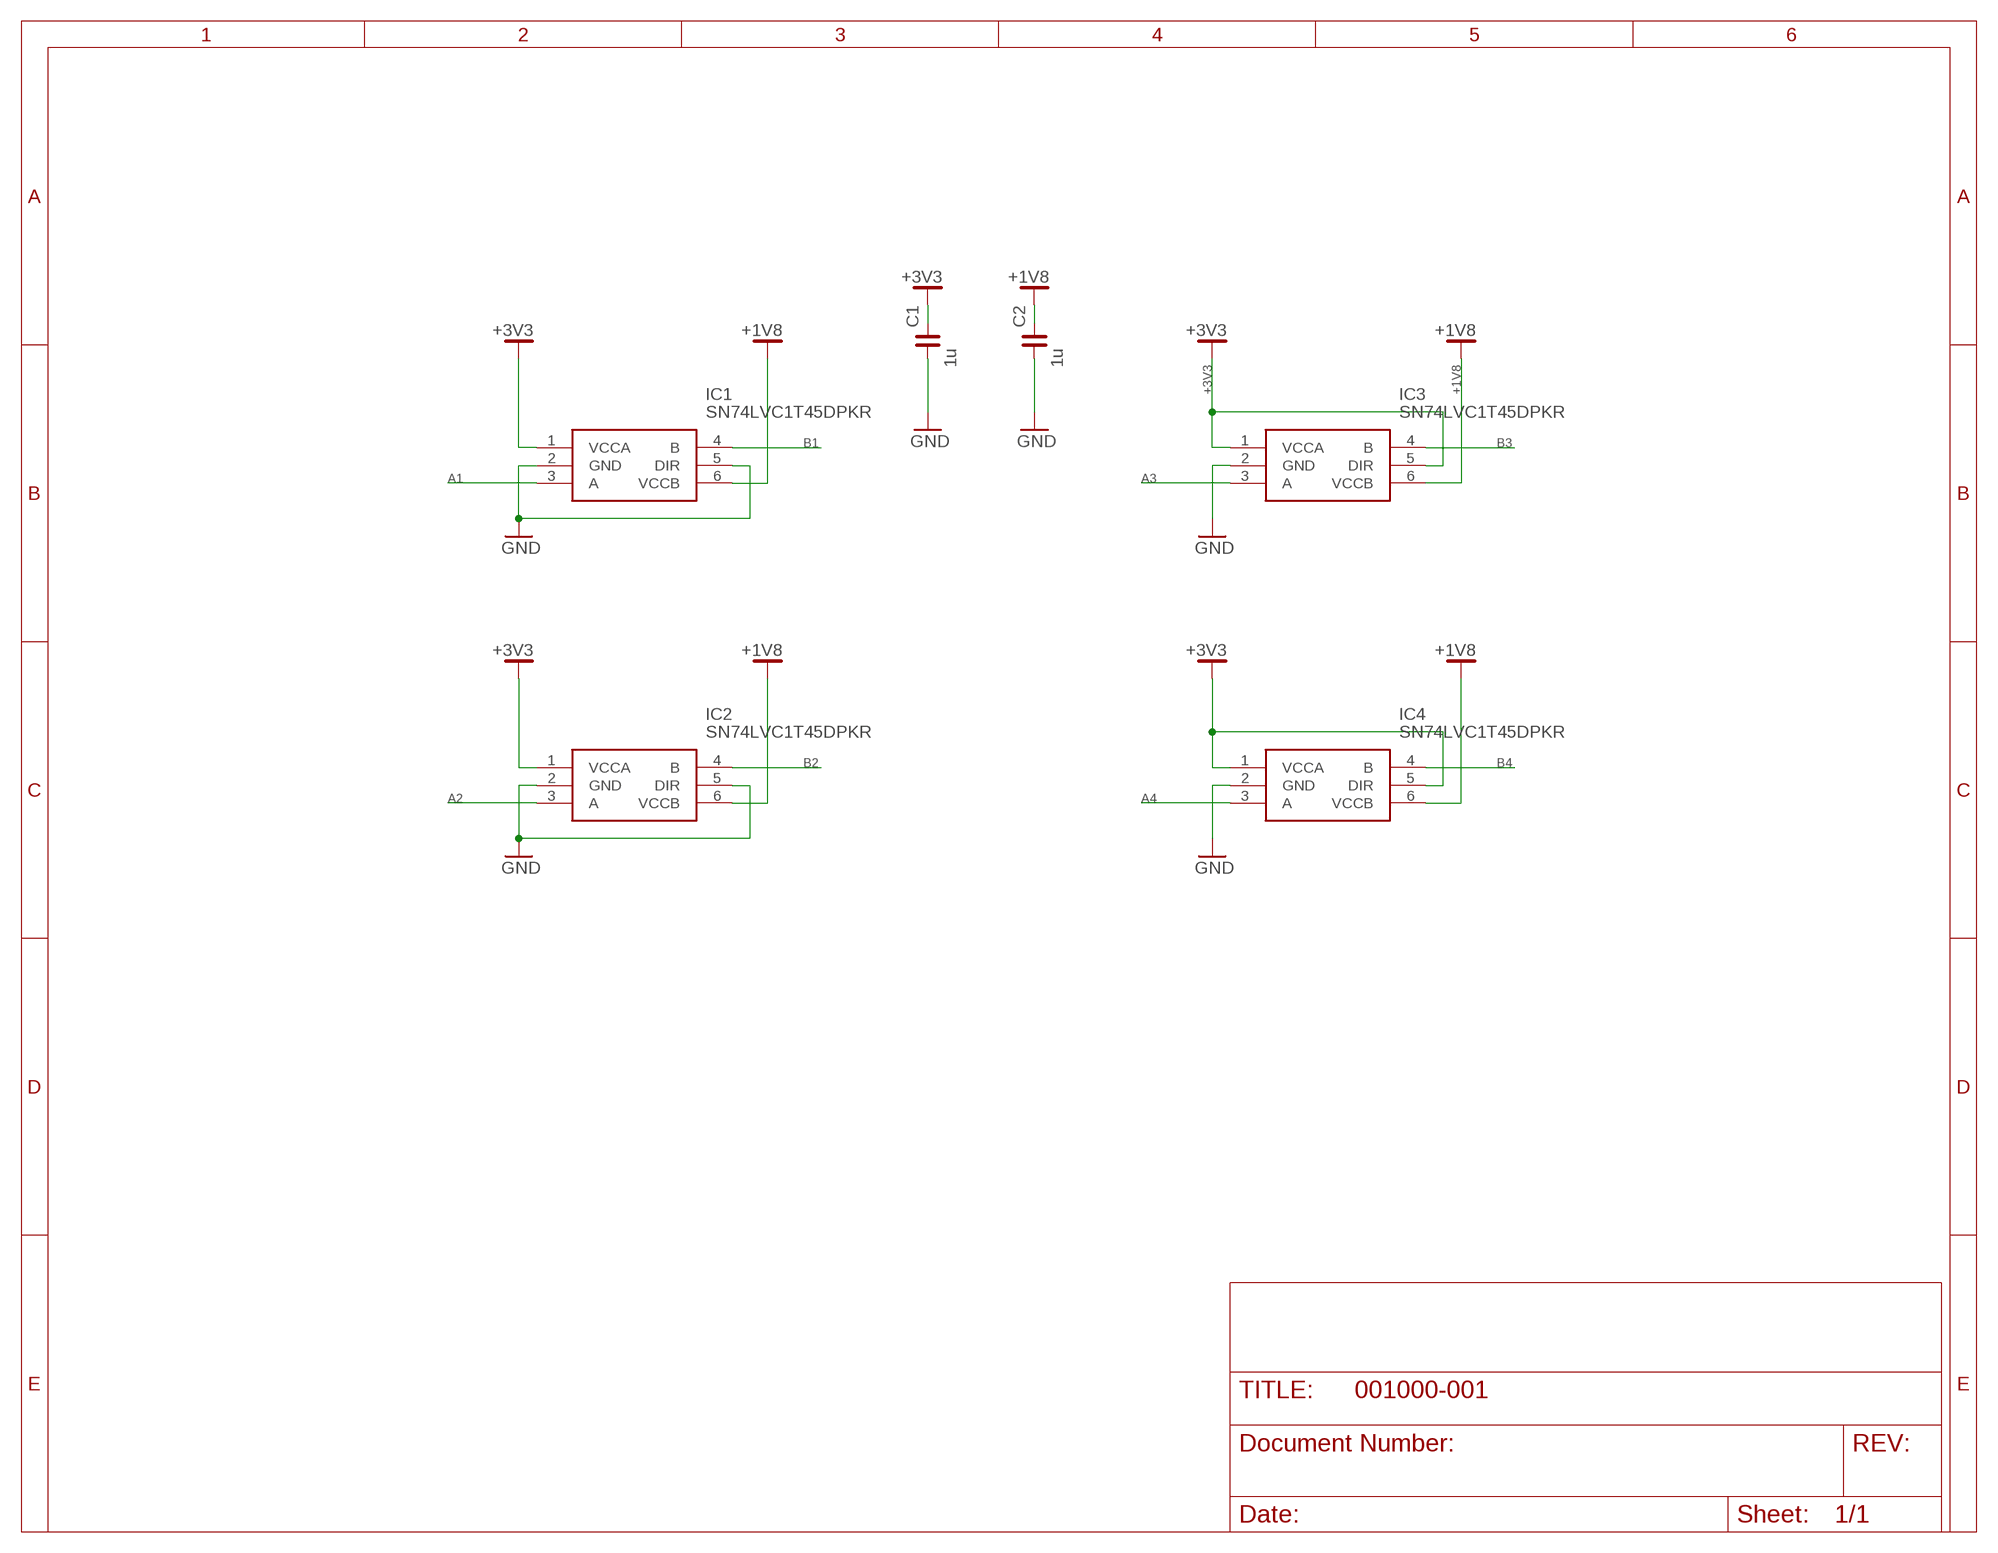
[diagram p6: schematic, module SHIFTER, sheet 1]

### Parts
C1  1u  C_0402  [C0402]
C2  1u  C_0402  [C0402]
IC1  SN74LVC1T45DPKR  [SN74LVC1T45DPKR]
IC2  SN74LVC1T45DPKR  [SN74LVC1T45DPKR]
IC3  SN74LVC1T45DPKR  [SN74LVC1T45DPKR]
IC4  SN74LVC1T45DPKR  [SN74LVC1T45DPKR]

### Nets
+1V8: C2.2 IC1.6(VCCB) IC2.6(VCCB) IC3.6(VCCB) IC4.6(VCCB)
+3V3: C1.2 IC1.1(VCCA) IC2.1(VCCA) IC3.1(VCCA) IC3.5(DIR) IC4.1(VCCA) IC4.5(DIR)
A1: IC1.3(A)
A2: IC2.3(A)
A3: IC3.3(A)
A4: IC4.3(A)
B1: IC1.4(B)
B2: IC2.4(B)
B3: IC3.4(B)
B4: IC4.4(B)
GND: C1.1 C2.1 IC1.2(GND) IC1.5(DIR) IC2.2(GND) IC2.5(DIR) IC3.2(GND) IC4.2(GND)

### Library data of the parts
C1 C2 = rc-master:C_: NON-POLARIZED CAP
IC1-IC4 = SamacSys_Parts:SN74LVC1T45DPKR: Single-Bit Dual-Supply Bus Transceiver with Configurable Voltage-Level Shifting and 3-State Outputs Source: Datasheet <http://www.ti.com/lit/gpn/sn74lvc1t45>; DESCRIPTION: Single-Bit Dual-Supply Bus Transceiver with Configurable Voltage-Level Shifting and 3-State Outputs; HEIGHT: mm; MANUFACTURER_NAME: Texas Instruments; MANUFACTURER_PART_NUMBER: SN74LVC1T45DPKR; MOUSER_PART_NUMBER: 595-SN74LVC1T45DPKR; MOUSER_PRICE-STOCK: https://www.mouser.com/Search/Refine.aspx?Keyword=595-SN74LVC1T45DPKR